# EAGLE schematic PDNode-600 Pro (EAGLE 9.2.1), part 1 of 2
COMPANY: DvidMakesThings; REVISION: 1.0.0; WEB: https://github.com/DvidMakesThings/HW_PDNode-600-Pro

## Sheet 1 of 15: MICROCONTROLLER - POWER
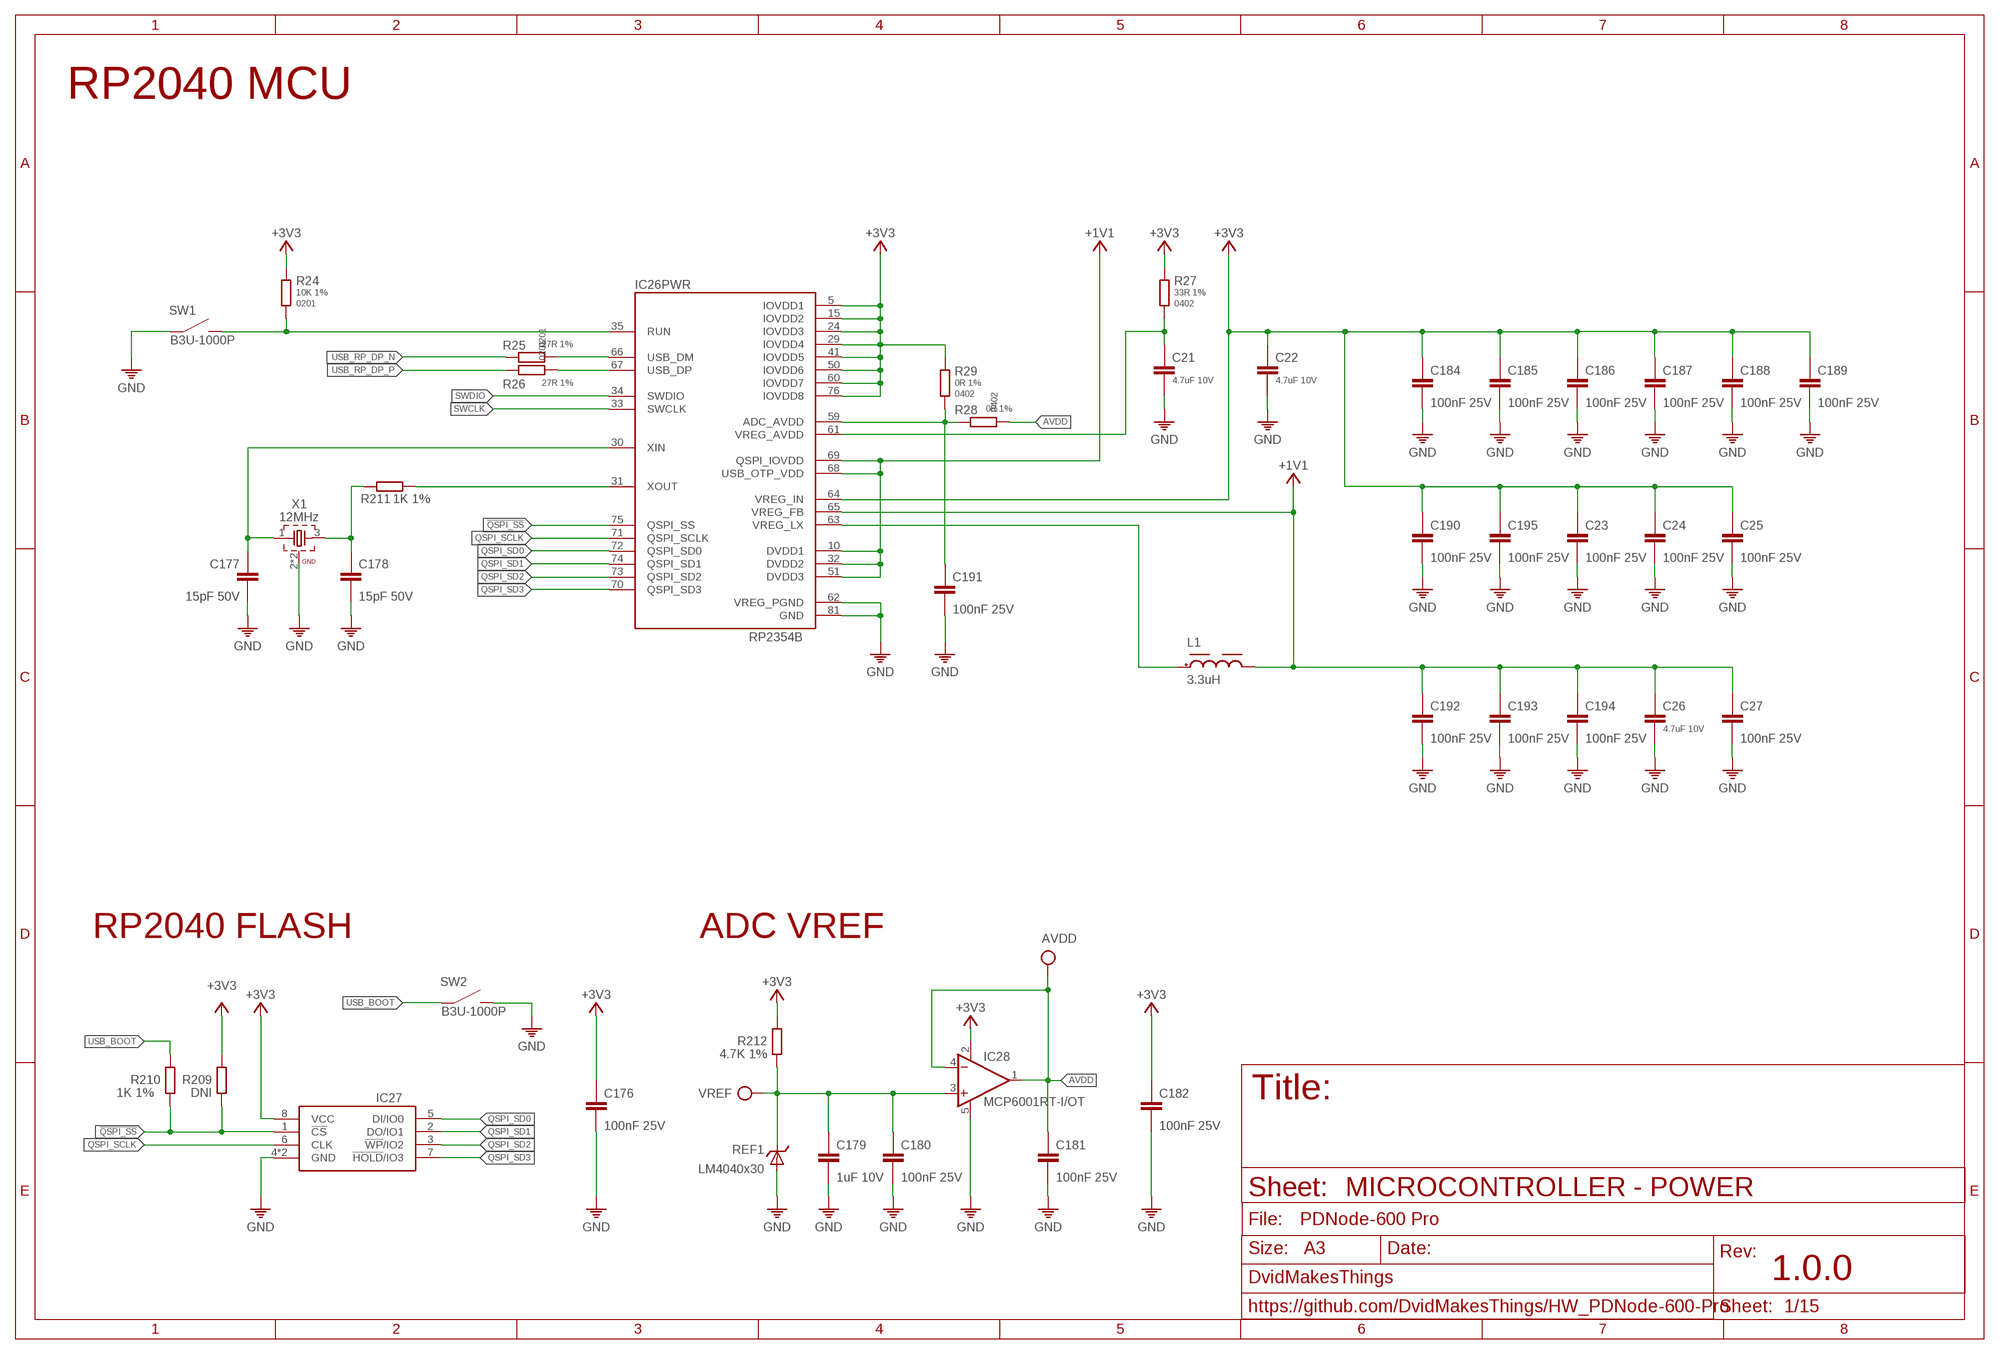
[diagram p0: schematic, sheet 1]

### Parts
AVDD  TESTPOINT  TP  [TP]
C21  4.7uF 10V  4.7UF-10V0402  [0402]
C22  4.7uF 10V  4.7UF-10V0402  [0402]
C23  100nF 25V  100NF-25V-0201  [0201]
C24  100nF 25V  100NF-25V-0201  [0201]
C25  100nF 25V  100NF-25V-0201  [0201]
C26  4.7uF 10V  4.7UF-10V0402  [0402]
C27  100nF 25V  100NF-25V-0201  [0201]
C176  100nF 25V  100NF-25V-0201  [0201]
C177  15pF 50V  15PF-50V0201  [0201]
C178  15pF 50V  15PF-50V0201  [0201]
C179  1uF 10V  1UF-10V0201  [0201]
C180  100nF 25V  100NF-25V-0201  [0201]
C181  100nF 25V  100NF-25V-0201  [0201]
C182  100nF 25V  100NF-25V-0201  [0201]
C184  100nF 25V  100NF-25V-0201  [0201]
C185  100nF 25V  100NF-25V-0201  [0201]
C186  100nF 25V  100NF-25V-0201  [0201]
C187  100nF 25V  100NF-25V-0201  [0201]
C188  100nF 25V  100NF-25V-0201  [0201]
C189  100nF 25V  100NF-25V-0201  [0201]
C190  100nF 25V  100NF-25V-0201  [0201]
C191  100nF 25V  100NF-25V-0201  [0201]
C192  100nF 25V  100NF-25V-0201  [0201]
C193  100nF 25V  100NF-25V-0201  [0201]
C194  100nF 25V  100NF-25V-0201  [0201]
C195  100nF 25V  100NF-25V-0201  [0201]
IC26  RP2354B  RP235XB  [QFN80-10X10]
IC27  W25Q128JVPIQ  W25Q128JVP  [SON127P600X500X75-8N]
IC28  MCP6001RT-I/OT  MCP6001RT  [SOT23-5]
L1  3.3uH  3.3UH0805  [0805]
R24  10K 1%  10K-1%0201  [0201]
R25  27R 1%  27R-1%0201  [0201]
R26  27R 1%  27R-1%0201  [0201]
R27  33R 1%  33R-1%0402  [0402]
R28  0R 1%  0R0402  [0402]
R29  0R 1%  0R0402  [0402]
R209  DNI  R0201  [R0201]
R210  1K 1%  1K-1%0201  [0201]
R211  1K 1%  1K-1%0201  [0201]
R212  4.7K 1%  4.7K-1%0201  [0201]
REF1  LM4040x30  LM4040BXX  [SOT23]
SW1  B3U-1000P  B3U-1000P  [B3U-1000P]
SW2  B3U-1000P  B3U-1000P  [B3U-1000P]
VREF  TESTPOINT  TP  [TP]
X1  12MHz  CRYSTAL-3225X322512MSB4SI  [WE-XTAL_CFPX-180]

### Nets
!QSPI_SS: IC26.75(PWR:QSPI_SS) IC27.1(!CS) R209.1 R210.2
+1V1: C26.1 C27.1 C192.1 C193.1 C194.1 IC26.10(PWR:DVDD1) IC26.32(PWR:DVDD2) IC26.51(PWR:DVDD3) IC26.65(PWR:VREG_FB) IC26.68(PWR:USB_OTP_VDD) IC26.69(PWR:QSPI_IOVDD) L1.2
+3V3: C22.1 C23.1 C24.1 C25.1 C176.1 C182.1 C184.1 C185.1 C186.1 C187.1 C188.1 C189.1 C190.1 C195.1 IC26.5(PWR:IOVDD1) IC26.15(PWR:IOVDD2) IC26.24(PWR:IOVDD3) IC26.29(PWR:IOVDD4) IC26.41(PWR:IOVDD5) IC26.50(PWR:IOVDD6) IC26.60(PWR:IOVDD7) IC26.64(PWR:VREG_IN) IC26.76(PWR:IOVDD8) IC27.8(VCC) IC28.2(V+) R24.1 R27.1 R29.1 R209.2 R212.2 ; also sheet 2,3,4,5,6,7,8
AVDD: AVDD.TP C181.1 IC28.1(OUT) IC28.4(-IN) R28.2
GND: C21.2 C22.2 C23.2 C24.2 C25.2 C26.2 C27.2 C176.2 C177.2 C178.2 C179.2 C180.2 C181.2 C182.2 C184.2 C185.2 C186.2 C187.2 C188.2 C189.2 C190.2 C191.2 C192.2 C193.2 C194.2 C195.2 IC26.62(PWR:VREG_PGND) IC26.81(PWR:GND) IC27.4(GND) IC27.PAD(GND) IC28.5(V-) REF1.2(A) REF1.3(A) SW1.1 SW2.2 X1.2(GND) X1.4(GND) ; also sheet 2,3,4,5,6,7,8
N$16: IC26.35(PWR:RUN) R24.2 SW1.2
N$17: IC26.66(PWR:USB_DM) R25.2
N$18: IC26.67(PWR:USB_DP) R26.2
N$20: C191.1 IC26.59(PWR:ADC_AVDD) R28.1 R29.2
N$21: C21.1 IC26.61(PWR:VREG_AVDD) R27.2
N$23: IC26.63(PWR:VREG_LX) L1.1
N$43: C178.1 R211.1 X1.3
QSPI_SCLK: IC26.71(PWR:QSPI_SCLK) IC27.6(CLK)
QSPI_SD0: IC26.72(PWR:QSPI_SD0) IC27.5(DI/IO0)
QSPI_SD1: IC26.74(PWR:QSPI_SD1) IC27.2(DO/IO1)
QSPI_SD2: IC26.73(PWR:QSPI_SD2) IC27.3(!WP!/IO2)
QSPI_SD3: IC26.70(PWR:QSPI_SD3) IC27.7(!HOLD!/IO3)
RP_XI: C177.1 IC26.30(PWR:XIN) X1.1
RP_XO: IC26.31(PWR:XOUT) R211.2
SWCLK: IC26.33(PWR:SWCLK)
SWDIO: IC26.34(PWR:SWDIO)
USB_BOOT: R210.1 SW2.1
USB_RP_DP_N: R25.1
USB_RP_DP_P: R26.1
VREF: C179.1 C180.1 IC28.3(+IN) R212.1 REF1.1(C) VREF.TP

### Notes on the sheet
- RP2040 MCU
- RP2040 FLASH | ADC VREF
- MICROCONTROLLER - POWER

## Sheet 2 of 15: MICROCONTROLLER - GPIO
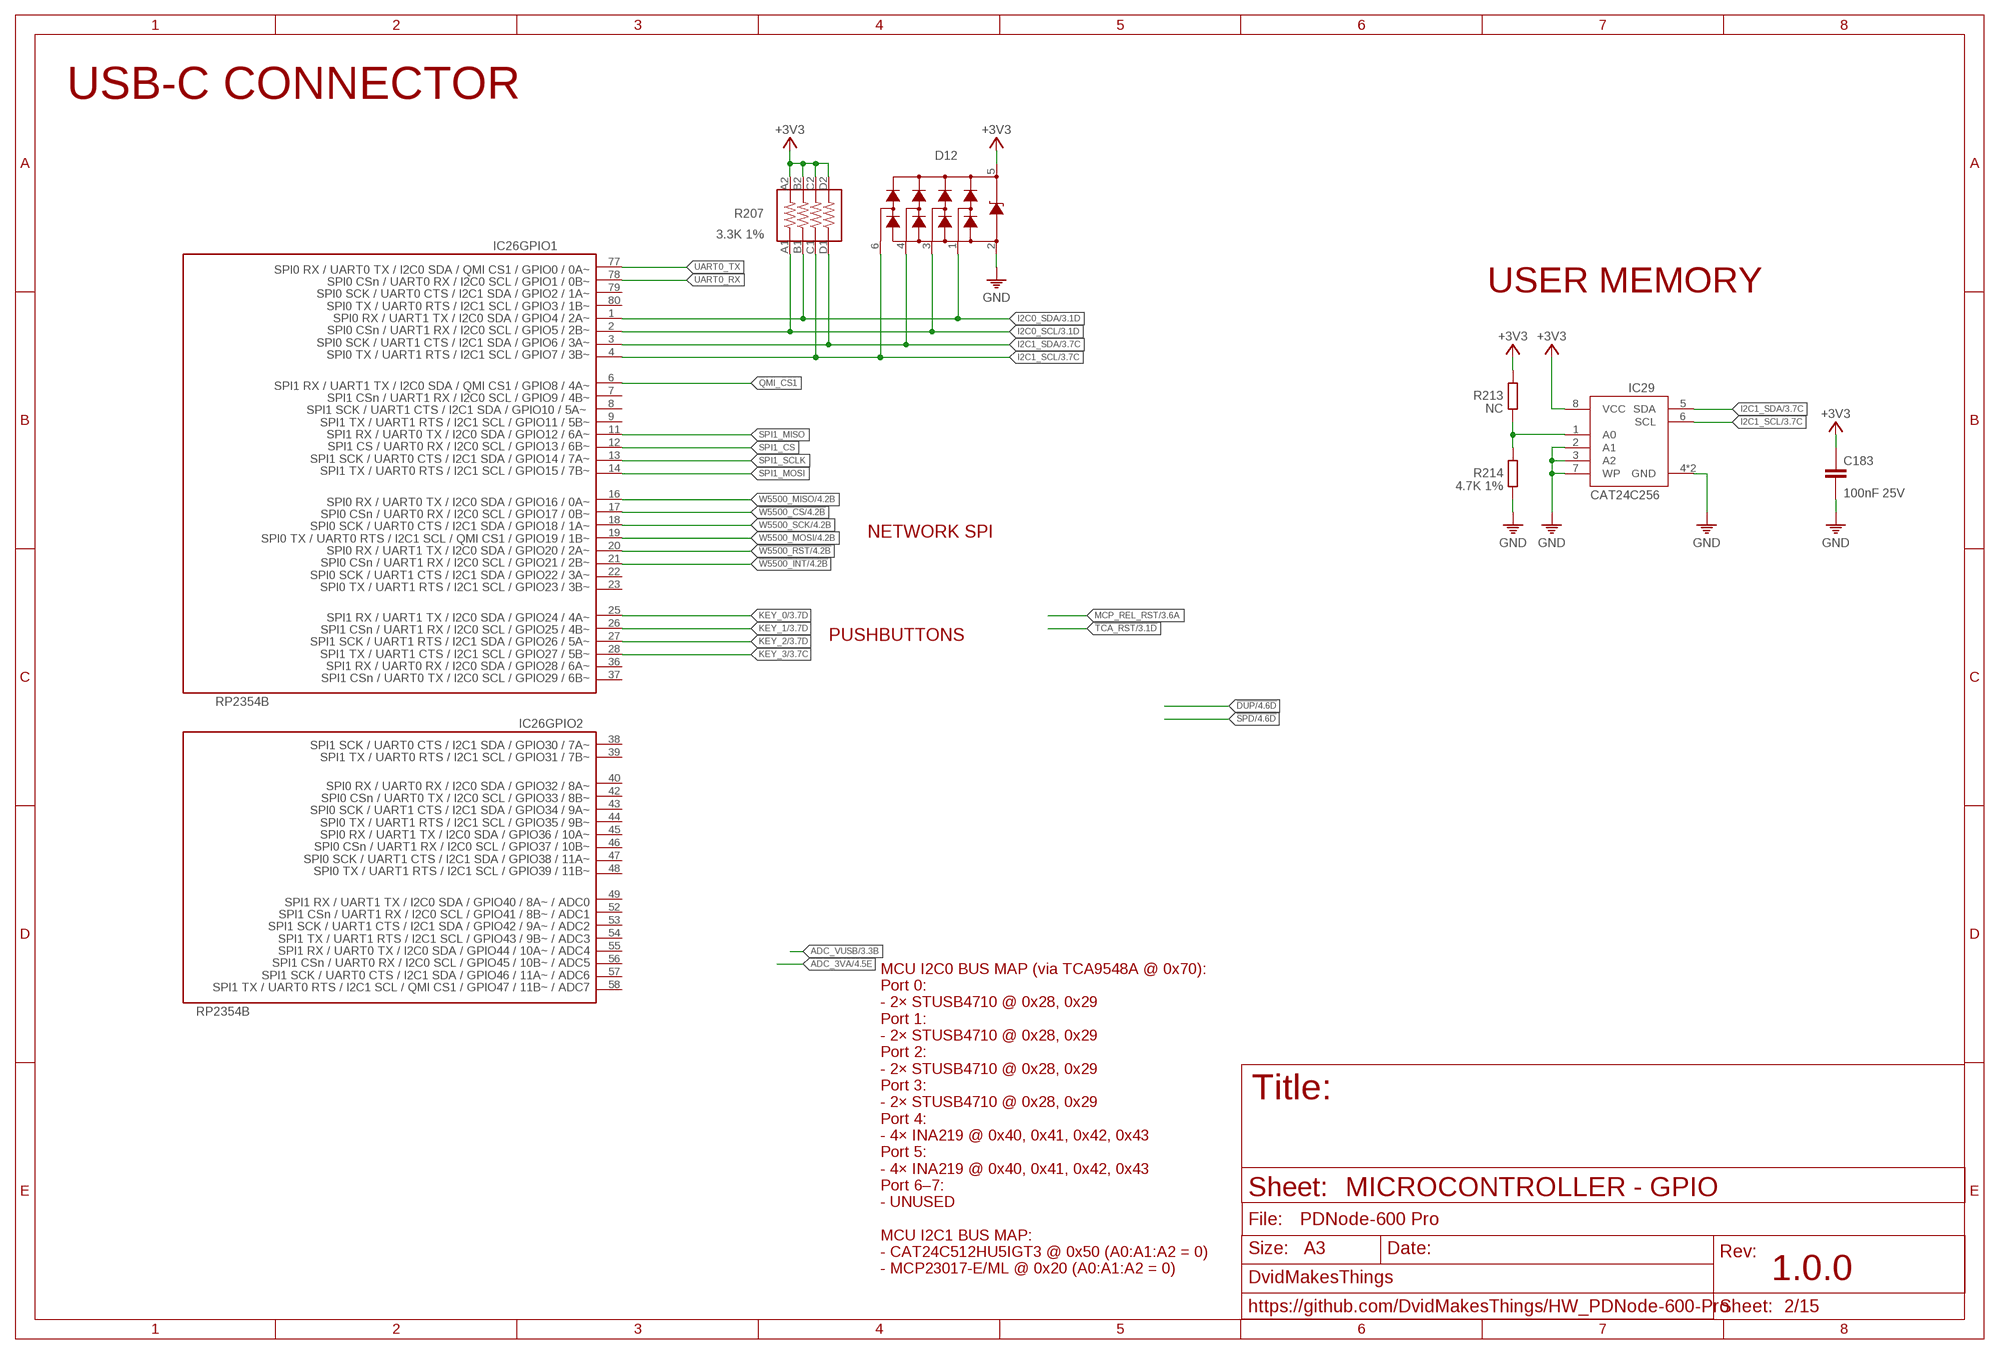
[diagram p1: schematic, sheet 2]

### Parts
C183  100nF 25V  100NF-25V-0201  [0201]
D12  HDMIULC6-4SC6Y  [SOT23-6]
IC29  CAT24C256HU4IGT3  CAT24C256-HU4  [SON50P300X200X50-9T130X140N]
R207  3.3K 1%  3.3K-1%_ARRAY0603X4-1206  [_0603X4-1206]
R213  NC  R0201  [R0201]
R214  4.7K 1%  4.7K-1%0201  [0201]

### Nets
!W5500_CS: IC26.17(GPIO1:GPIO17) ; also sheet 4
!W5500_INT: IC26.21(GPIO1:GPIO21) ; also sheet 4
!W5500_RST: IC26.20(GPIO1:GPIO20) ; also sheet 4
+3V3: C183.1 D12.5 IC29.8(VCC) R207.A2 R207.B2 R207.C2 R207.D2 R213.2 ; also sheet 1,3,4,5,6,7,8
GND: C183.2 D12.2 IC29.2(A1) IC29.3(A2) IC29.4(GND) IC29.7(WP) IC29.9(GND) R214.1 ; also sheet 1,3,4,5,6,7,8
I2C0_SCL: D12.3 IC26.2(GPIO1:GPIO5) R207.A1 ; also sheet 3
I2C0_SDA: D12.1 IC26.1(GPIO1:GPIO4) R207.B1 ; also sheet 3
I2C1_SCL: D12.6 IC26.4(GPIO1:GPIO7) IC29.6(SCL) R207.C1 ; also sheet 3
I2C1_SDA: D12.4 IC26.3(GPIO1:GPIO6) IC29.5(SDA) R207.D1 ; also sheet 3
KEY_0: IC26.25(GPIO1:GPIO24) ; also sheet 3
KEY_1: IC26.26(GPIO1:GPIO25) ; also sheet 3
KEY_2: IC26.27(GPIO1:GPIO26) ; also sheet 3
KEY_3: IC26.28(GPIO1:GPIO27) ; also sheet 3
N$222: IC29.1(A0) R213.1 R214.2
QMI_CS1: IC26.6(GPIO1:GPIO8)
SPI1_CS: IC26.12(GPIO1:GPIO13)
SPI1_MISO: IC26.11(GPIO1:GPIO12)
SPI1_MOSI: IC26.14(GPIO1:GPIO15)
SPI1_SCLK: IC26.13(GPIO1:GPIO14)
UART0_RX: IC26.78(GPIO1:GPIO1)
UART0_TX: IC26.77(GPIO1:GPIO0)
W5500_MISO: IC26.16(GPIO1:GPIO16) ; also sheet 4
W5500_MOSI: IC26.19(GPIO1:GPIO19) ; also sheet 4
W5500_SCK: IC26.18(GPIO1:GPIO18) ; also sheet 4
Unconnected: IC26.7(GPIO1:GPIO9) IC26.8(GPIO1:GPIO10) IC26.9(GPIO1:GPIO11) IC26.22(GPIO1:GPIO22) IC26.23(GPIO1:GPIO23) IC26.36(GPIO1:GPIO28) IC26.37(GPIO1:GPIO29) IC26.38(GPIO2:GPIO30) IC26.39(GPIO2:GPIO31) IC26.40(GPIO2:GPIO32) IC26.42(GPIO2:GPIO33) IC26.43(GPIO2:GPIO34) IC26.44(GPIO2:GPIO35) IC26.45(GPIO2:GPIO36) IC26.46(GPIO2:GPIO37) IC26.47(GPIO2:GPIO38) IC26.48(GPIO2:GPIO39) IC26.49(GPIO2:GPIO40_ADC0) IC26.52(GPIO2:GPIO41_ADC1) IC26.53(GPIO2:GPIO42_ADC2) IC26.54(GPIO2:GPIO43_ADC3) IC26.55(GPIO2:GPIO44_ADC4) IC26.56(GPIO2:GPIO45_ADC5) IC26.57(GPIO2:GPIO46_ADC6) IC26.58(GPIO2:GPIO47_ADC7) IC26.79(GPIO1:GPIO2) IC26.80(GPIO1:GPIO3)

### Notes on the sheet
- USB-C CONNECTOR
- USER MEMORY
- NETWORK SPI
- PUSHBUTTONS
- MICROCONTROLLER - GPIO
- MCU I2C0 BUS MAP (via TCA9548A @ 0x70):
  Port 0:
  - 2× STUSB4710 @ 0x28, 0x29
  Port 1:
  - 2× STUSB4710 @ 0x28, 0x29
  Port 2:
  - 2× STUSB4710 @ 0x28, 0x29
  Port 3:
  - 2× STUSB4710 @ 0x28, 0x29
  Port 4:
  - 4× INA219 @ 0x40, 0x41, 0x42, 0x43
  Port 5:
  - 4× INA219 @ 0x40, 0x41, 0x42, 0x43
  Port 6–7:
  - UNUSED
  
  MCU I2C1 BUS MAP:
  - CAT24C512HU5IGT3 @ 0x50 (A0:A1:A2 = 0)
  - MCP23017-E/ML @ 0x20 (A0:A1:A2 = 0)

## Sheet 3 of 15: PERIPHERALS
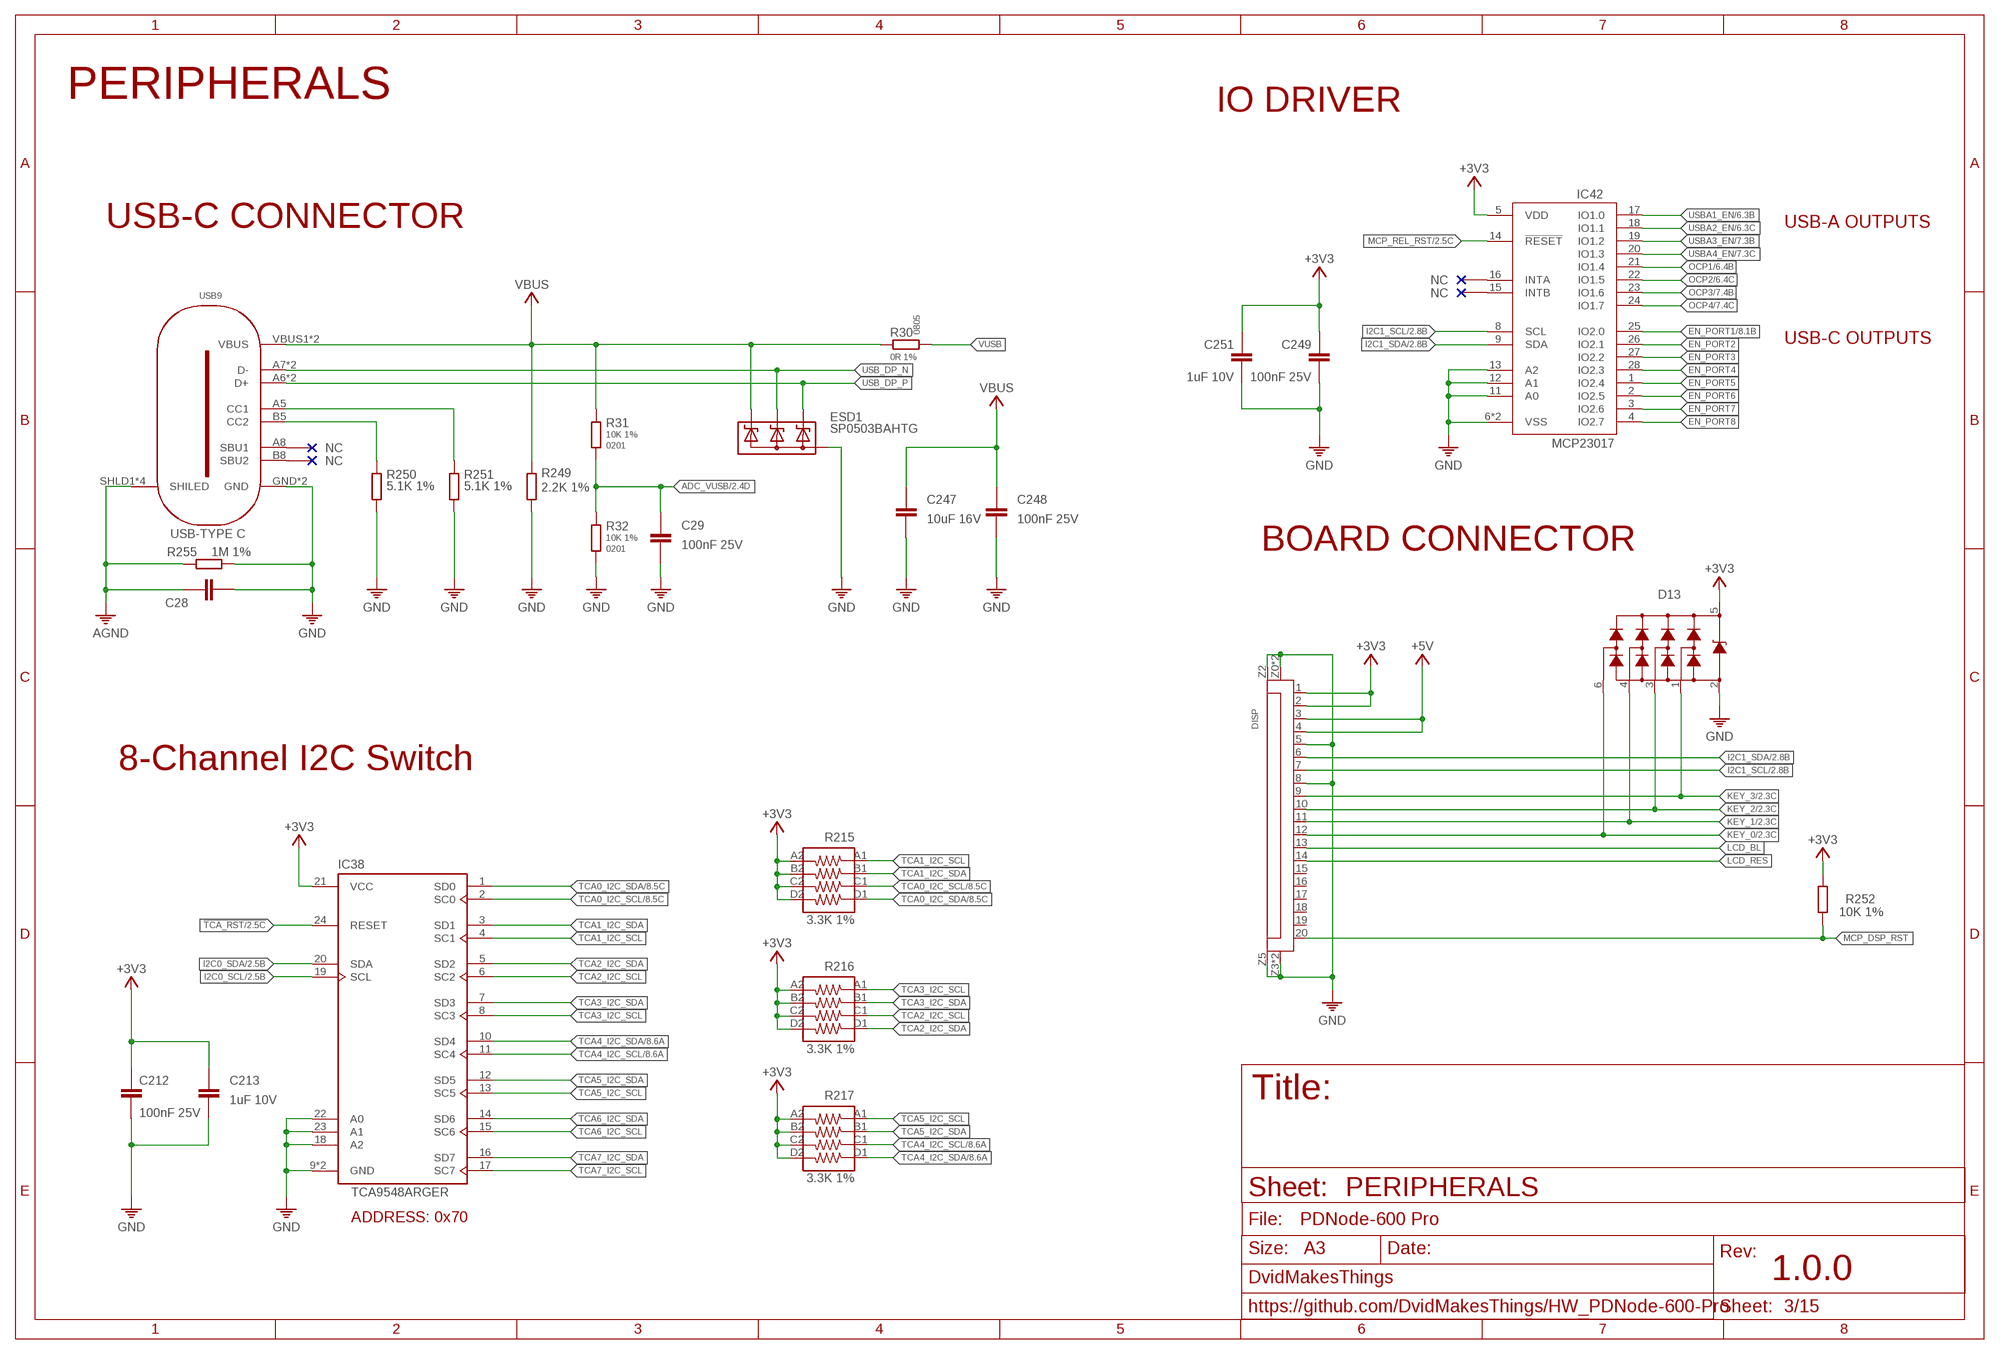
[diagram p2: schematic, sheet 3]

### Parts
C28  1NF-2KV  [1206]
C29  100nF 25V  100NF-25V-0402  [0402]
C212  100nF 25V  100NF-25V-0201  [0201]
C213  1uF 10V  1UF-10V0201  [0201]
C247  10uF 16V  10UF-16V-0603  [0603]
C248  100nF 25V  100NF-25V-0402  [0402]
C249  100nF 25V  100NF-25V-0201  [0201]
C251  1uF 10V  1UF-10V0201  [0201]
D13  HDMIULC6-4SC6Y  [SOT23-6]
DISP  AFC11-S20ICC-00  AFC11-S20ICC-00  [FPC20]
ESD1  SP0503BAHTG  SP0503BAHT  [SOT143]
IC38  TCA9548ARGER  [QFN50P400X400X100-25T210N]
IC42  MCP23017T-E/ML  MCP23017-E/ML  [QFN28[6X6]ML]
R30  0R 1%  0R0805  [0805]
R31  10K 1%  10K-1%0201  [0201]
R32  10K 1%  10K-1%0201  [0201]
R215  3.3K 1%  3.3K-1%_ARRAY0603X4-1206  [_0603X4-1206]
R216  3.3K 1%  3.3K-1%_ARRAY0603X4-1206  [_0603X4-1206]
R217  3.3K 1%  3.3K-1%_ARRAY0603X4-1206  [_0603X4-1206]
R249  2.2K 1%  2.2K-1%0201  [0201]
R250  5.1K 1%  5.1K-1%0201  [0201]
R251  5.1K 1%  5.1K-1%0201  [0201]
R252  10K 1%  10K-1%0201  [0201]
R255  1M 1%  1M-1%0603  [0603]
USB9  USB-TYPE-C-018  USB_C-THT  [USB-C]

### Nets
!TCA_RST: IC38.24(RESET) ; also sheet 2
+3V3: C212.1 C213.1 C249.1 C251.1 D13.5 DISP.1 DISP.2 IC38.21(VCC) IC42.5(VDD) R215.A2 R215.B2 R215.C2 R215.D2 R216.A2 R216.B2 R216.C2 R216.D2 R217.A2 R217.B2 R217.C2 R217.D2 R252.2 ; also sheet 1,2,4,5,6,7,8
+5V: DISP.3 DISP.4
ADC_VUSB: C29.1 R31.2 R32.1 ; also sheet 2
AGND: C28.1 R255.1 USB9.SHLD1(SHILED) USB9.SHLD2(SHILED) USB9.SHLD3(SHILED) USB9.SHLD4(SHILED) ; also sheet 5,6,7,8
CC1: R251.1 USB9.A5(CC1)
CC2: R250.1 USB9.B5(CC2)
EN_PORT1: IC42.25(IO2.0) ; also sheet 8
EN_PORT2: IC42.26(IO2.1)
EN_PORT3: IC42.27(IO2.2)
EN_PORT4: IC42.28(IO2.3)
EN_PORT5: IC42.1(IO2.4)
EN_PORT6: IC42.2(IO2.5)
EN_PORT7: IC42.3(IO2.6)
EN_PORT8: IC42.4(IO2.7)
GND: C28.2 C29.2 C212.2 C213.2 C247.2 C248.2 C249.2 C251.2 D13.2 DISP.5 DISP.8 DISP.Z0(Z1) DISP.Z1 DISP.Z2 DISP.Z3 DISP.Z4(Z3) DISP.Z5(Z4) ESD1.1(A) IC38.9(GND) IC38.18(A2) IC38.22(A0) IC38.23(A1) IC38.25(GND) IC42.6(VSS) IC42.11(A0) IC42.12(A1) IC42.13(A2) IC42.PAD(VSS) R32.2 R249.2 R250.2 R251.2 R255.2 USB9.GND USB9.GND2(GND) ; also sheet 1,2,4,5,6,7,8
I2C0_SCL: IC38.19(SCL) ; also sheet 2
I2C0_SDA: IC38.20(SDA) ; also sheet 2
I2C1_SCL: DISP.7 IC42.8(SCL) ; also sheet 2
I2C1_SDA: DISP.6 IC42.9(SDA) ; also sheet 2
KEY_0: D13.6 DISP.12 ; also sheet 2
KEY_1: D13.4 DISP.11 ; also sheet 2
KEY_2: D13.3 DISP.10 ; also sheet 2
KEY_3: D13.1 DISP.9 ; also sheet 2
LCD_BL: DISP.13
LCD_RES: DISP.14
MCP_DSP_RST: DISP.20 R252.1
MCP_REL_RST: IC42.14(!RESET) ; also sheet 2
OCP1: IC42.21(IO1.4) ; also sheet 6
OCP2: IC42.22(IO1.5) ; also sheet 6
OCP3: IC42.23(IO1.6) ; also sheet 7
OCP4: IC42.24(IO1.7) ; also sheet 7
TCA0_I2C_SCL: IC38.2(SC0) R215.C1 ; also sheet 8
TCA0_I2C_SDA: IC38.1(SD0) R215.D1 ; also sheet 8
TCA1_I2C_SCL: IC38.4(SC1) R215.A1
TCA1_I2C_SDA: IC38.3(SD1) R215.B1
TCA2_I2C_SCL: IC38.6(SC2) R216.C1
TCA2_I2C_SDA: IC38.5(SD2) R216.D1
TCA3_I2C_SCL: IC38.8(SC3) R216.A1
TCA3_I2C_SDA: IC38.7(SD3) R216.B1
TCA4_I2C_SCL: IC38.11(SC4) R217.C1 ; also sheet 8
TCA4_I2C_SDA: IC38.10(SD4) R217.D1 ; also sheet 8
TCA5_I2C_SCL: IC38.13(SC5) R217.A1
TCA5_I2C_SDA: IC38.12(SD5) R217.B1
TCA6_I2C_SCL: IC38.15(SC6)
TCA6_I2C_SDA: IC38.14(SD6)
TCA7_I2C_SCL: IC38.17(SC7)
TCA7_I2C_SDA: IC38.16(SD7)
USB_DP_N [90R_DIFFPAIR]: ESD1.3(C2) USB9.A7(D-) USB9.B7(D-)
USB_DP_P [90R_DIFFPAIR]: ESD1.2(C1) USB9.A6(D+) USB9.B6(D+)
USBA1_EN: IC42.17(IO1.0) ; also sheet 6
USBA2_EN: IC42.18(IO1.1) ; also sheet 6
USBA3_EN: IC42.19(IO1.2) ; also sheet 7
USBA4_EN: IC42.20(IO1.3) ; also sheet 7
VBUS: C247.1 C248.1 ESD1.4(C3) R30.1 R31.1 R249.1 USB9.VBUS1(VBUS) USB9.VBUS2(VBUS)
VUSB: R30.2
Unconnected: DISP.15 DISP.16 DISP.17 DISP.18 DISP.19 IC42.15(INTB) IC42.16(INTA) USB9.A8(SBU1) USB9.B8(SBU2)

### Notes on the sheet
- PERIPHERALS
- IO DRIVER
- USB-C CONNECTOR | USB-A OUTPUTS
- USB-C OUTPUTS
- BOARD CONNECTOR
- 8-Channel I2C Switch
- PERIPHERALS
- ADDRESS: 0x70

## Sheet 4 of 15: ETHERNET CONTROLLER
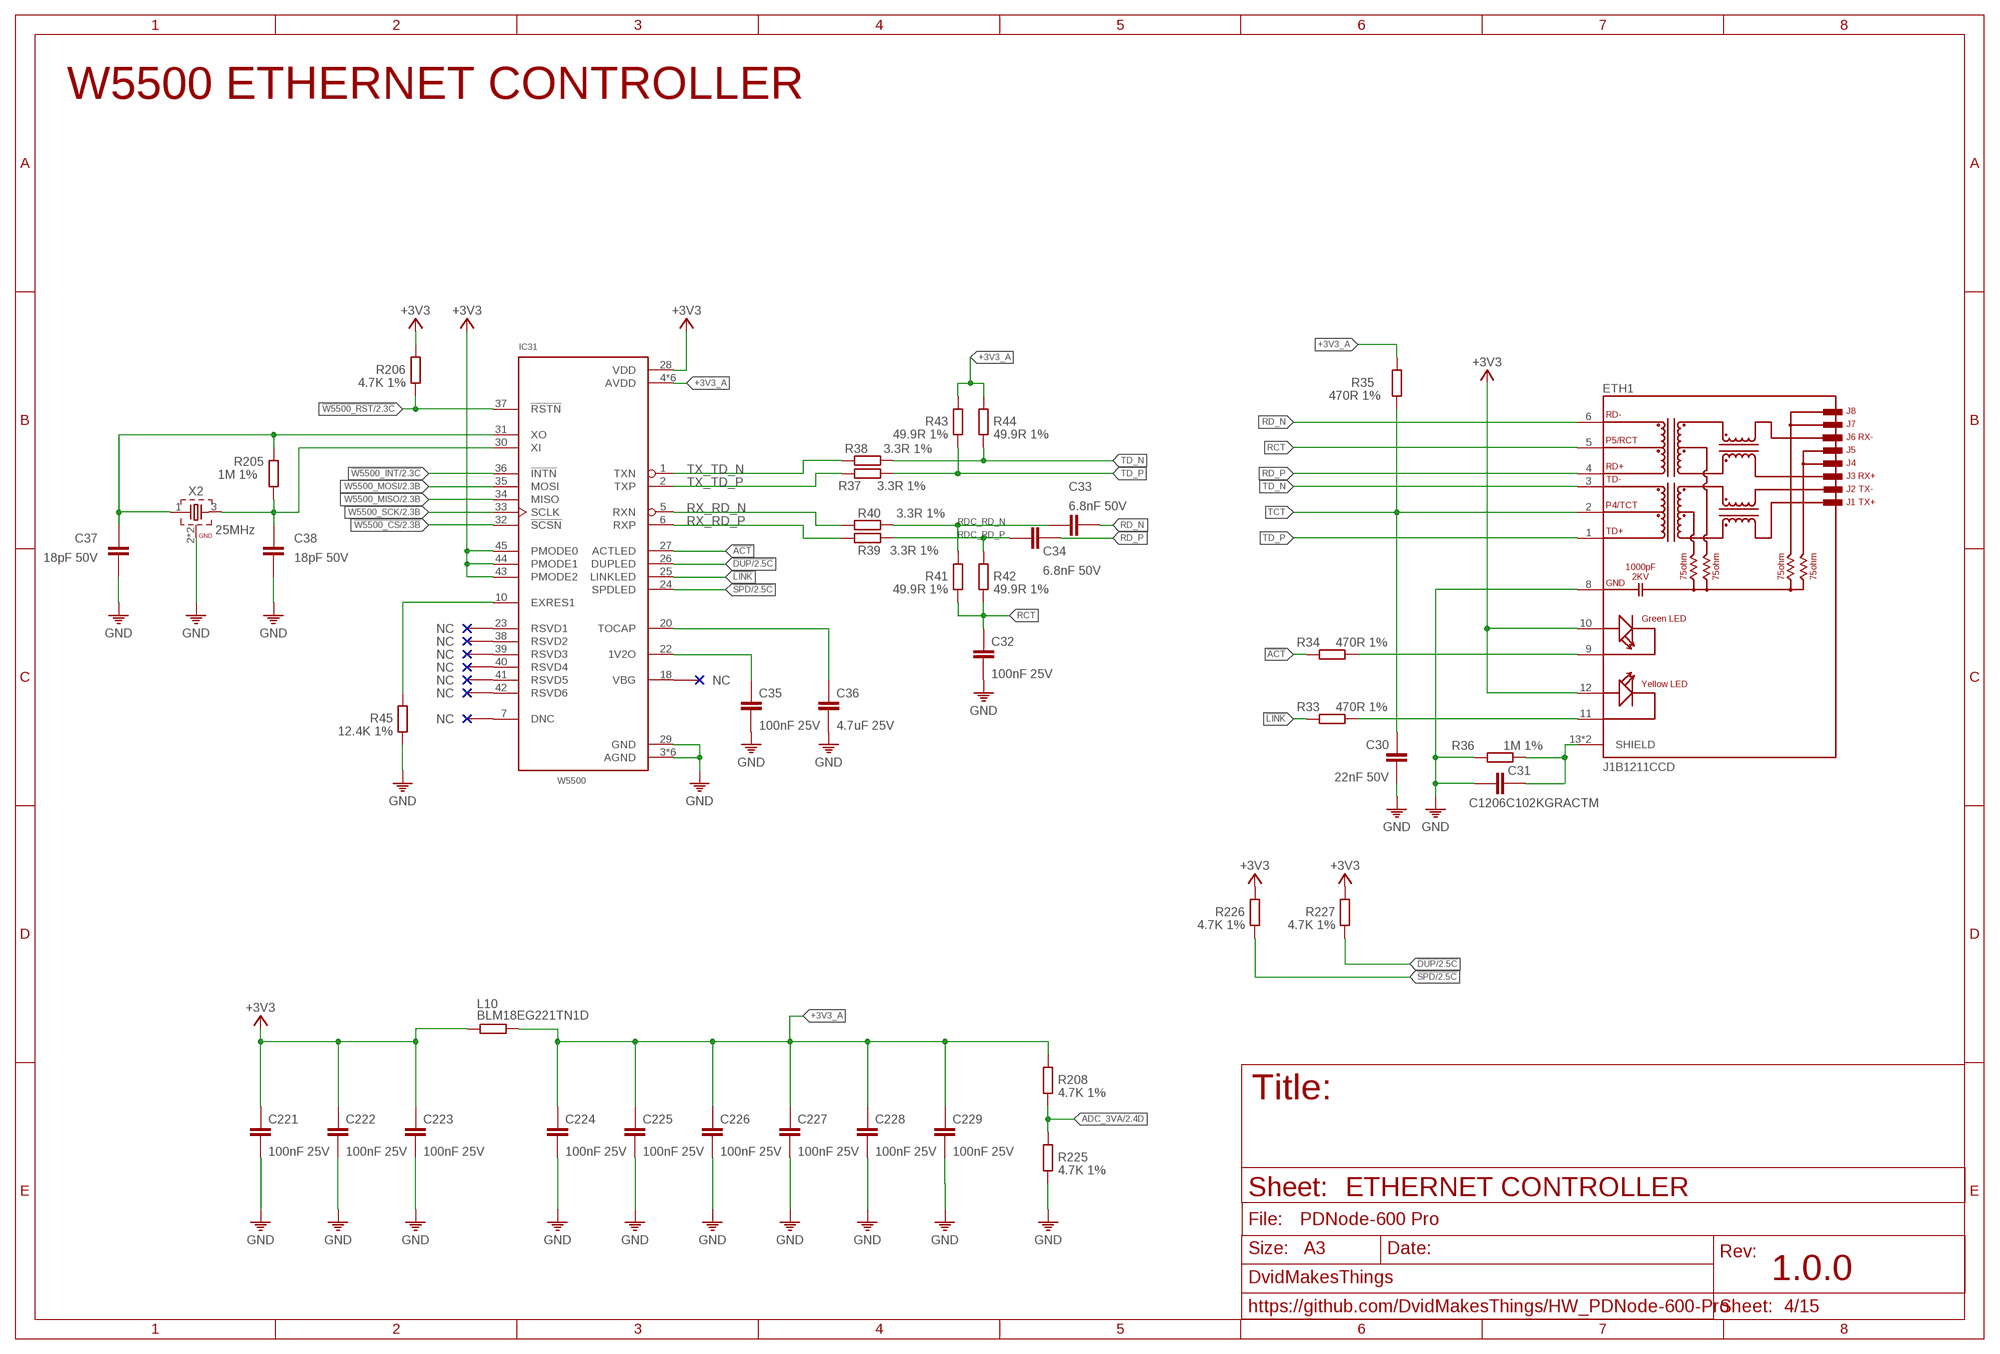
[diagram p3: schematic, sheet 4]

### Parts
C30  22nF 50V  22NF-50V0402  [0402]
C31  C1206C102KGRACTM  C-1206  [C1206]
C32  100nF 25V  100NF-25V-0402  [0402]
C33  6.8nF 50V  6.8NF-50V0201  [0201]
C34  6.8nF 50V  6.8NF-50V0201  [0201]
C35  100nF 25V  100NF-25V-0201  [0201]
C36  4.7uF 25V  4.7UF-25V0402  [0402]
C37  18pF 50V  18PF-50V-0201  [0201]
C38  18pF 50V  18PF-50V-0201  [0201]
C221  100nF 25V  100NF-25V-0201  [0201]
C222  100nF 25V  100NF-25V-0201  [0201]
C223  100nF 25V  100NF-25V-0201  [0201]
C224  100nF 25V  100NF-25V-0201  [0201]
C225  100nF 25V  100NF-25V-0201  [0201]
C226  100nF 25V  100NF-25V-0201  [0201]
C227  100nF 25V  100NF-25V-0201  [0201]
C228  100nF 25V  100NF-25V-0201  [0201]
C229  100nF 25V  100NF-25V-0201  [0201]
ETH1  J1B1211CCD  [J1B1211CCD]
IC31  W5500  [LQFP48]
L10  BLM18EG221TN1D  R0603  [0603]
R33  470R 1%  470R-1%0402  [0402]
R34  470R 1%  470R-1%0402  [0402]
R35  470R 1%  470R-1%0402  [0402]
R36  1M 1%  1M-1%1206  [1206]
R37  3.3R 1%  3.3R-1%0201  [0201]
R38  3.3R 1%  3.3R-1%0201  [0201]
R39  3.3R 1%  3.3R-1%0201  [0201]
R40  3.3R 1%  3.3R-1%0201  [0201]
R41  49.9R 1%  49.9R-1%0201  [0201]
R42  49.9R 1%  49.9R-1%0201  [0201]
R43  49.9R 1%  49.9R-1%0201  [0201]
R44  49.9R 1%  49.9R-1%0201  [0201]
R45  12.4K 1%  R0201  [R0201]
R205  1M 1%  1M-1%0201  [0201]
R206  4.7K 1%  4.7K-1%0201  [0201]
R208  4.7K 1%  4.7K-1%0201  [0201]
R225  4.7K 1%  4.7K-1%0201  [0201]
R226  4.7K 1%  4.7K-1%0201  [0201]
R227  4.7K 1%  4.7K-1%0201  [0201]
X2  25MHz  CRYSTAL-3225X322525MOB4SI  [WE-XTAL_CFPX-180]

### Nets
!ACT: IC31.27(ACTLED) R34.1
!DUP: IC31.26(DUPLED) R227.1 ; also sheet 2
!LINK: IC31.25(LINKLED) R33.1
!SPD: IC31.24(SPDLED) R226.1 ; also sheet 2
!W5500_CS: IC31.32(!SCSN) ; also sheet 2
!W5500_INT: IC31.36(!INTN) ; also sheet 2
!W5500_RST: IC31.37(!RSTN) R206.1 ; also sheet 2
+3V3: C221.1 C222.1 C223.1 ETH1.10(GREEN+) ETH1.12(YELLOW+) IC31.28(VDD) IC31.43(PMODE2) IC31.44(PMODE1) IC31.45(PMODE0) L10.1 R206.2 R226.2 R227.2 ; also sheet 1,2,3,5,6,7,8
+3V3_A: C224.1 C225.1 C226.1 C227.1 C228.1 C229.1 IC31.4(AVDD) IC31.8(AVDD) IC31.11(AVDD) IC31.15(AVDD) IC31.17(AVDD) IC31.21(AVDD) L10.2 R35.2 R43.2 R44.2 R208.2
ADC_3VA: R208.1 R225.2 ; also sheet 2
GND: C30.2 C31.1 C32.2 C35.2 C36.2 C37.2 C38.2 C221.2 C222.2 C223.2 C224.2 C225.2 C226.2 C227.2 C228.2 C229.2 ETH1.8(GND) IC31.3(AGND) IC31.9(AGND) IC31.14(AGND) IC31.16(AGND) IC31.19(AGND) IC31.29(GND) IC31.48(AGND) R36.1 R45.1 R225.1 X2.2(GND) X2.4(GND) ; also sheet 1,2,3,5,6,7,8
N$19: ETH1.11(YELLOW-) R33.2
N$22: ETH1.9(GREEN-) R34.2
N$24: IC31.10(EXRES1) R45.2
N$25: C35.1 IC31.22(1V2O)
N$26: C36.1 IC31.20(TOCAP)
N$27: C38.1 IC31.30(XI) R205.1 X2.3
RCT: C32.1 ETH1.5(P5/RCT) R41.1 R42.1
RD_N [100R_DIFFPAIR]: C33.2 ETH1.6(RD-)
RD_P [100R_DIFFPAIR]: C34.2 ETH1.4(RD+)
RDC_RD_N [100R_DIFFPAIR]: C33.1 R40.2 R41.2
RDC_RD_P [100R_DIFFPAIR]: C34.1 R39.2 R42.2
RX_RD_N [100R_DIFFPAIR]: IC31.5(RXN) R40.1
RX_RD_P [100R_DIFFPAIR]: IC31.6(RXP) R39.1
SH: C31.2 ETH1.13(SHIELD) ETH1.14(SHIELD) R36.2
TCT: C30.1 ETH1.2(P4/TCT) R35.1
TD_N [100R_DIFFPAIR]: ETH1.3(TD-) R38.2 R44.1
TD_P [100R_DIFFPAIR]: ETH1.1(TD+) R37.2 R43.1
TX_TD_N [100R_DIFFPAIR]: IC31.1(TXN) R38.1
TX_TD_P [100R_DIFFPAIR]: IC31.2(TXP) R37.1
W5500_MISO: IC31.34(MISO) ; also sheet 2
W5500_MOSI: IC31.35(MOSI) ; also sheet 2
W5500_SCK: IC31.33(SCLK) ; also sheet 2
XO: C37.1 IC31.31(XO) R205.2 X2.1
Unconnected: IC31.7(DNC) IC31.18(VBG) IC31.23(RSVD1) IC31.38(RSVD2) IC31.39(RSVD3) IC31.40(RSVD4) IC31.41(RSVD5) IC31.42(RSVD6)

### Notes on the sheet
- W5500 ETHERNET CONTROLLER
- ETHERNET CONTROLLER

## Sheet 5 of 15: POWER
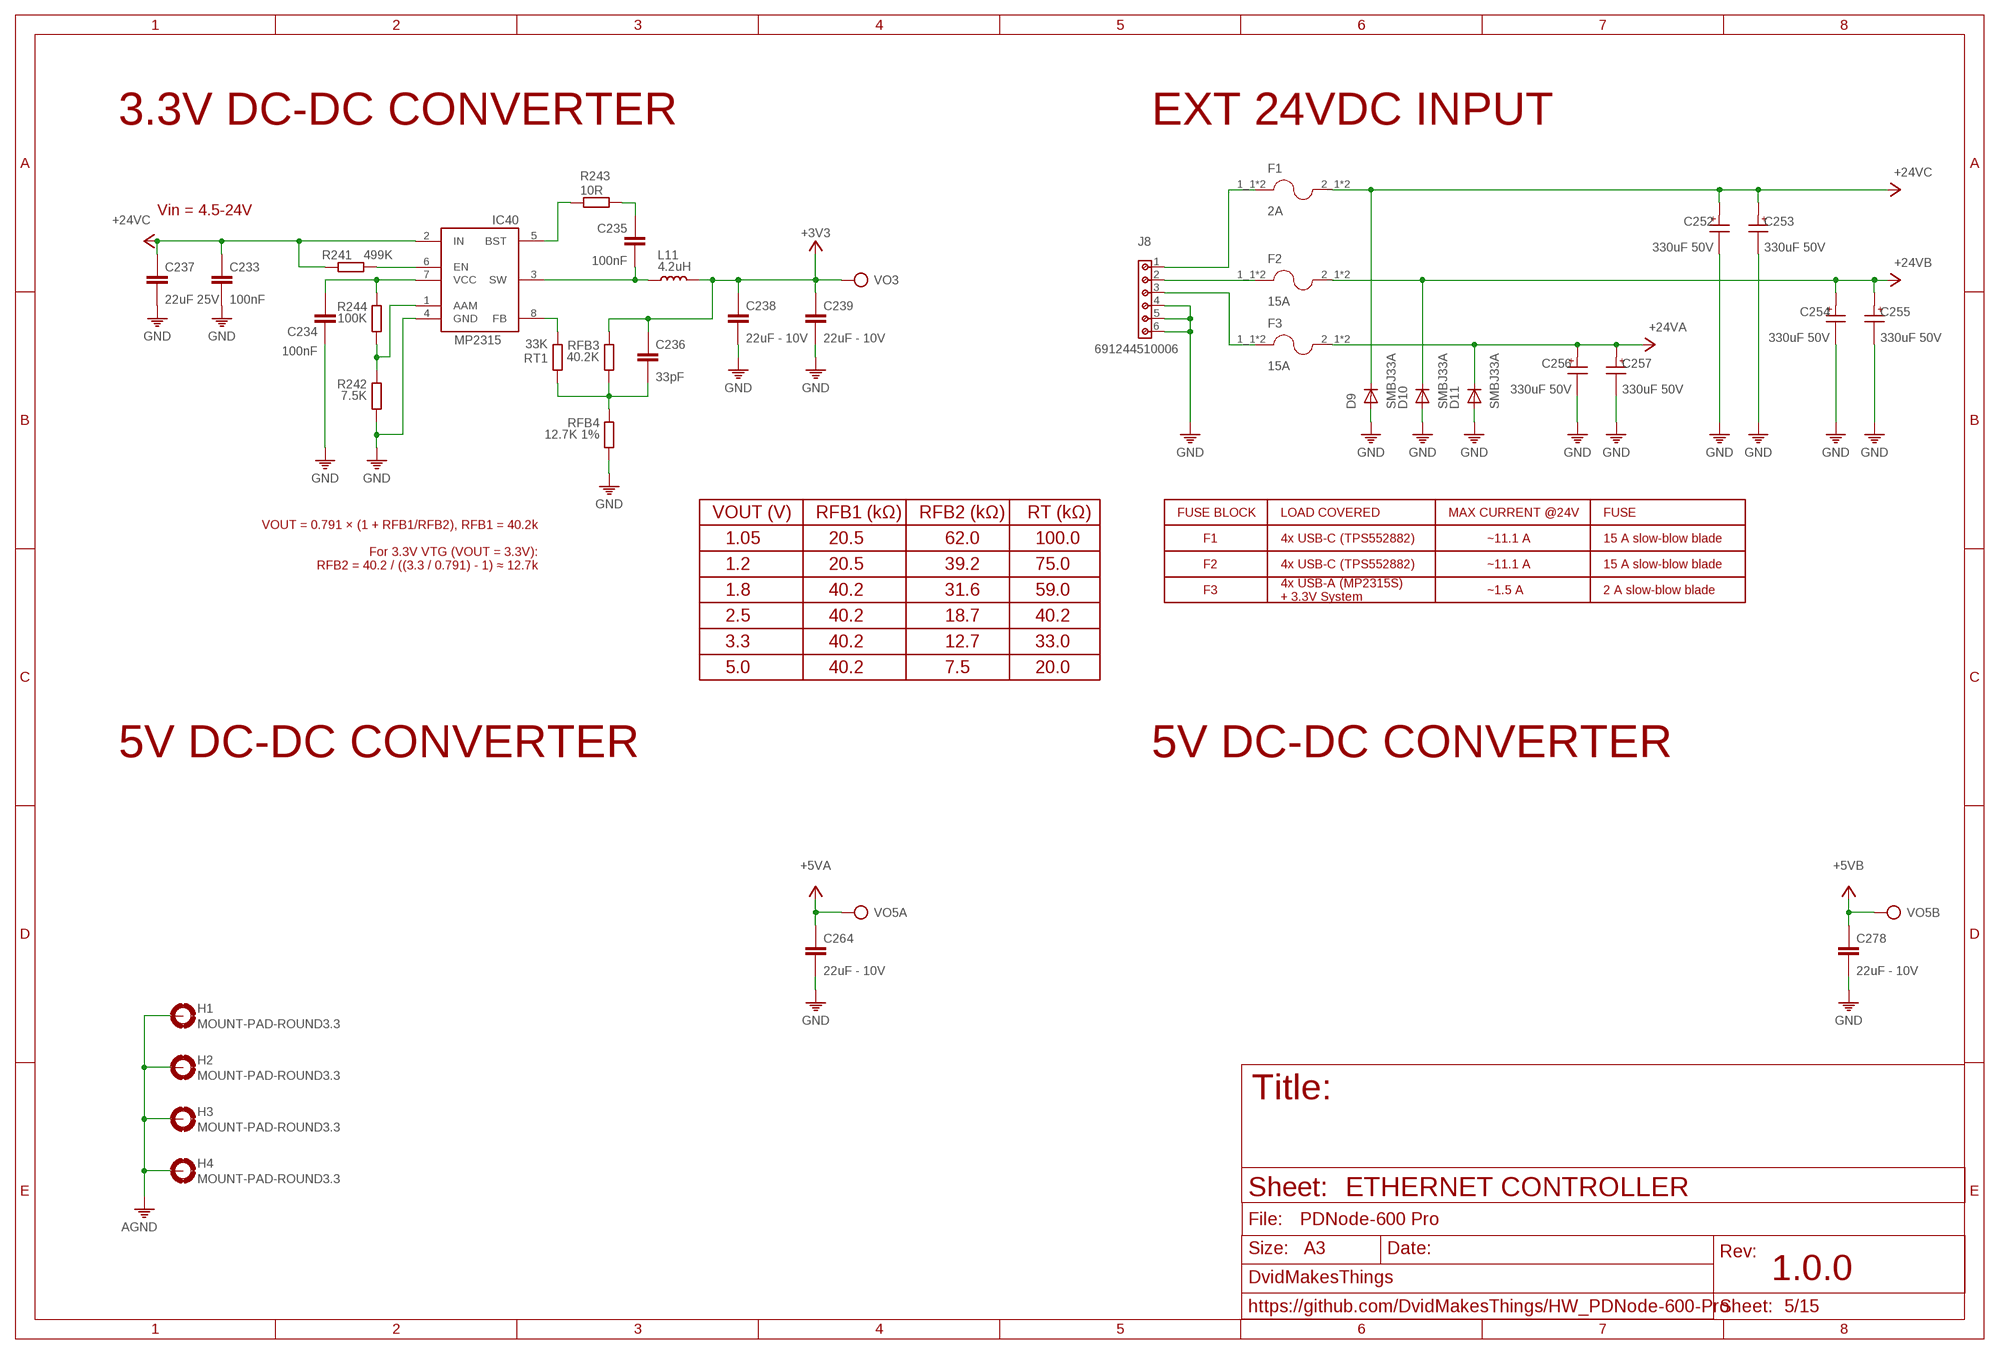
[diagram p4: schematic, sheet 5]

### Parts
C233  100nF  C-0201  [0201]
C234  100nF  C-0201  [0201]
C235  100nF  C-0201  [0201]
C236  33pF  C-0201  [0201]
C237  22uF 25V  C-1206  [C1206]
C238  22uF - 10V  C-1206  [C1206]
C239  22uF - 10V  C-1206  [C1206]
C252  330uF 50V  330UF-50V10X10.5(DXL)  [10X10.5(DXL)]
C253  330uF 50V  330UF-50V10X10.5(DXL)  [10X10.5(DXL)]
C254  330uF 50V  330UF-50V10X10.5(DXL)  [10X10.5(DXL)]
C255  330uF 50V  330UF-50V10X10.5(DXL)  [10X10.5(DXL)]
C256  330uF 50V  330UF-50V10X10.5(DXL)  [10X10.5(DXL)]
C257  330uF 50V  330UF-50V10X10.5(DXL)  [10X10.5(DXL)]
C264  22uF - 10V  C-1206  [C1206]
C278  22uF - 10V  C-1206  [C1206]
D9  SMBJ33A  DIODE-SMB  [SMB]
D10  SMBJ33A  DIODE-SMB  [SMB]
D11  SMBJ33A  DIODE-SMB  [SMB]
F1  2A  BLADE-FUSE  [FUSE_3544-2]
F2  15A  BLADE-FUSE  [FUSE_3544-2]
F3  15A  BLADE-FUSE  [FUSE_3544-2]
H1  MOUNT-PAD-ROUND3.3  [3,3-PAD]
H2  MOUNT-PAD-ROUND3.3  [3,3-PAD]
H3  MOUNT-PAD-ROUND3.3  [3,3-PAD]
H4  MOUNT-PAD-ROUND3.3  [3,3-PAD]
IC40  MP2315GJ-Z  MP2315TSOT23-8  [SOT65P280X110-8N]
J8  691244510006  [691244510006]
L11  4.2uH  L  [SRR5228A]
R241  499K  R0201  [R0201]
R242  7.5K  R0201  [R0201]
R243  10R  R0201  [R0201]
R244  100K  R0201  [R0201]
RFB3  40.2K  R0201  [R0201]
RFB4  12.7K 1%  R0201  [R0201]
RT1  33K  R0201  [R0201]
VO3  TESTPOINT  TP  [TP]
VO5A  TESTPOINT  TP  [TP]
VO5B  TESTPOINT  TP  [TP]

### Nets
3V3_EN_SYS1: IC40.6(EN) R241.2
24VINA: F2.1_1 F2.1_2 J8.2
24VINB: F3.1_1 F3.1_2 J8.3
24VINC: F1.1_1 F1.1_2 J8.1
+3V3: C236.1 C238.1 C239.1 L11.2 RFB3.1 VO3.TP ; also sheet 1,2,3,4,6,7,8
+5VA: C264.1 VO5A.TP ; also sheet 6
+5VB: C278.1 VO5B.TP ; also sheet 7
+24V_A: C256.1(+) C257.1(+) D11.C F3.2_1 F3.2_2 ; supply symbol labelled +24VA ; also sheet 8
+24V_B: C254.1(+) C255.1(+) D10.C F2.2_1 F2.2_2 ; supply symbol labelled +24VB
+24V_C: C233.1 C237.1 C252.1(+) C253.1(+) D9.C F1.2_1 F1.2_2 IC40.2(IN) R241.1 ; supply symbol labelled +24VC
AGND: H1.B3,3(MOUNT) H2.B3,3(MOUNT) H3.B3,3(MOUNT) H4.B3,3(MOUNT) ; also sheet 3,6,7,8
GND: C233.2 C234.2 C237.2 C238.2 C239.2 C252.2(-) C253.2(-) C254.2(-) C255.2(-) C256.2(-) C257.2(-) C264.2 C278.2 D9.A D10.A D11.A IC40.4(GND) J8.4 J8.5 J8.6 R242.2 RFB4.2 ; also sheet 1,2,3,4,6,7,8
N$267: IC40.5(BST) R243.2
N$268: IC40.8(FB) RT1.1
N$269: C235.2 IC40.3(SW) L11.1
N$270: C235.1 R243.1
N$271: C236.2 RFB3.2 RFB4.1 RT1.2
N$275: C234.1 IC40.7(VCC) R244.1
N$276: IC40.1(AAM) R242.1 R244.2

### Notes on the sheet
- 3.3V DC-DC CONVERTER | EXT 24VDC INPUT
- Vin = 4.5-24V
- VOUT (V) | RFB1 (kΩ) | RFB2 (kΩ) | RT (kΩ) | FUSE BLOCK | LOAD COVERED | MAX CURRENT @24V | FUSE
- 1.05 | 20.5 | 62.0 | 100.0 | F1 | 4x USB-C (TPS552882) | ~11.1 A | 15 A slow-blow blade
- 1.2 | 20.5 | 39.2 | 75.0 | F2 | 4x USB-C (TPS552882) | ~11.1 A | 15 A slow-blow blade
- VOUT = 0.791 × (1 + RFB1/RFB2), RFB1 = 40.2k
  
  For 3.3V VTG (VOUT = 3.3V):
     RFB2 = 40.2 / ((3.3 / 0.791) - 1) ≈ 12.7k
- 1.8 | 40.2 | 31.6 | 59.0 | F3
- 4x USB-A (MP2315S) 
  + 3.3V System
- ~1.5 A | 2 A slow-blow blade
- 2.5 | 40.2 | 18.7 | 40.2
- 3.3 | 40.2 | 12.7 | 33.0
- 5.0 | 40.2 | 7.5 | 20.0
- 5V DC-DC CONVERTER | 5V DC-DC CONVERTER
- ETHERNET CONTROLLER

## Sheet 6 of 15: USB-A SOURCE PORT1-2
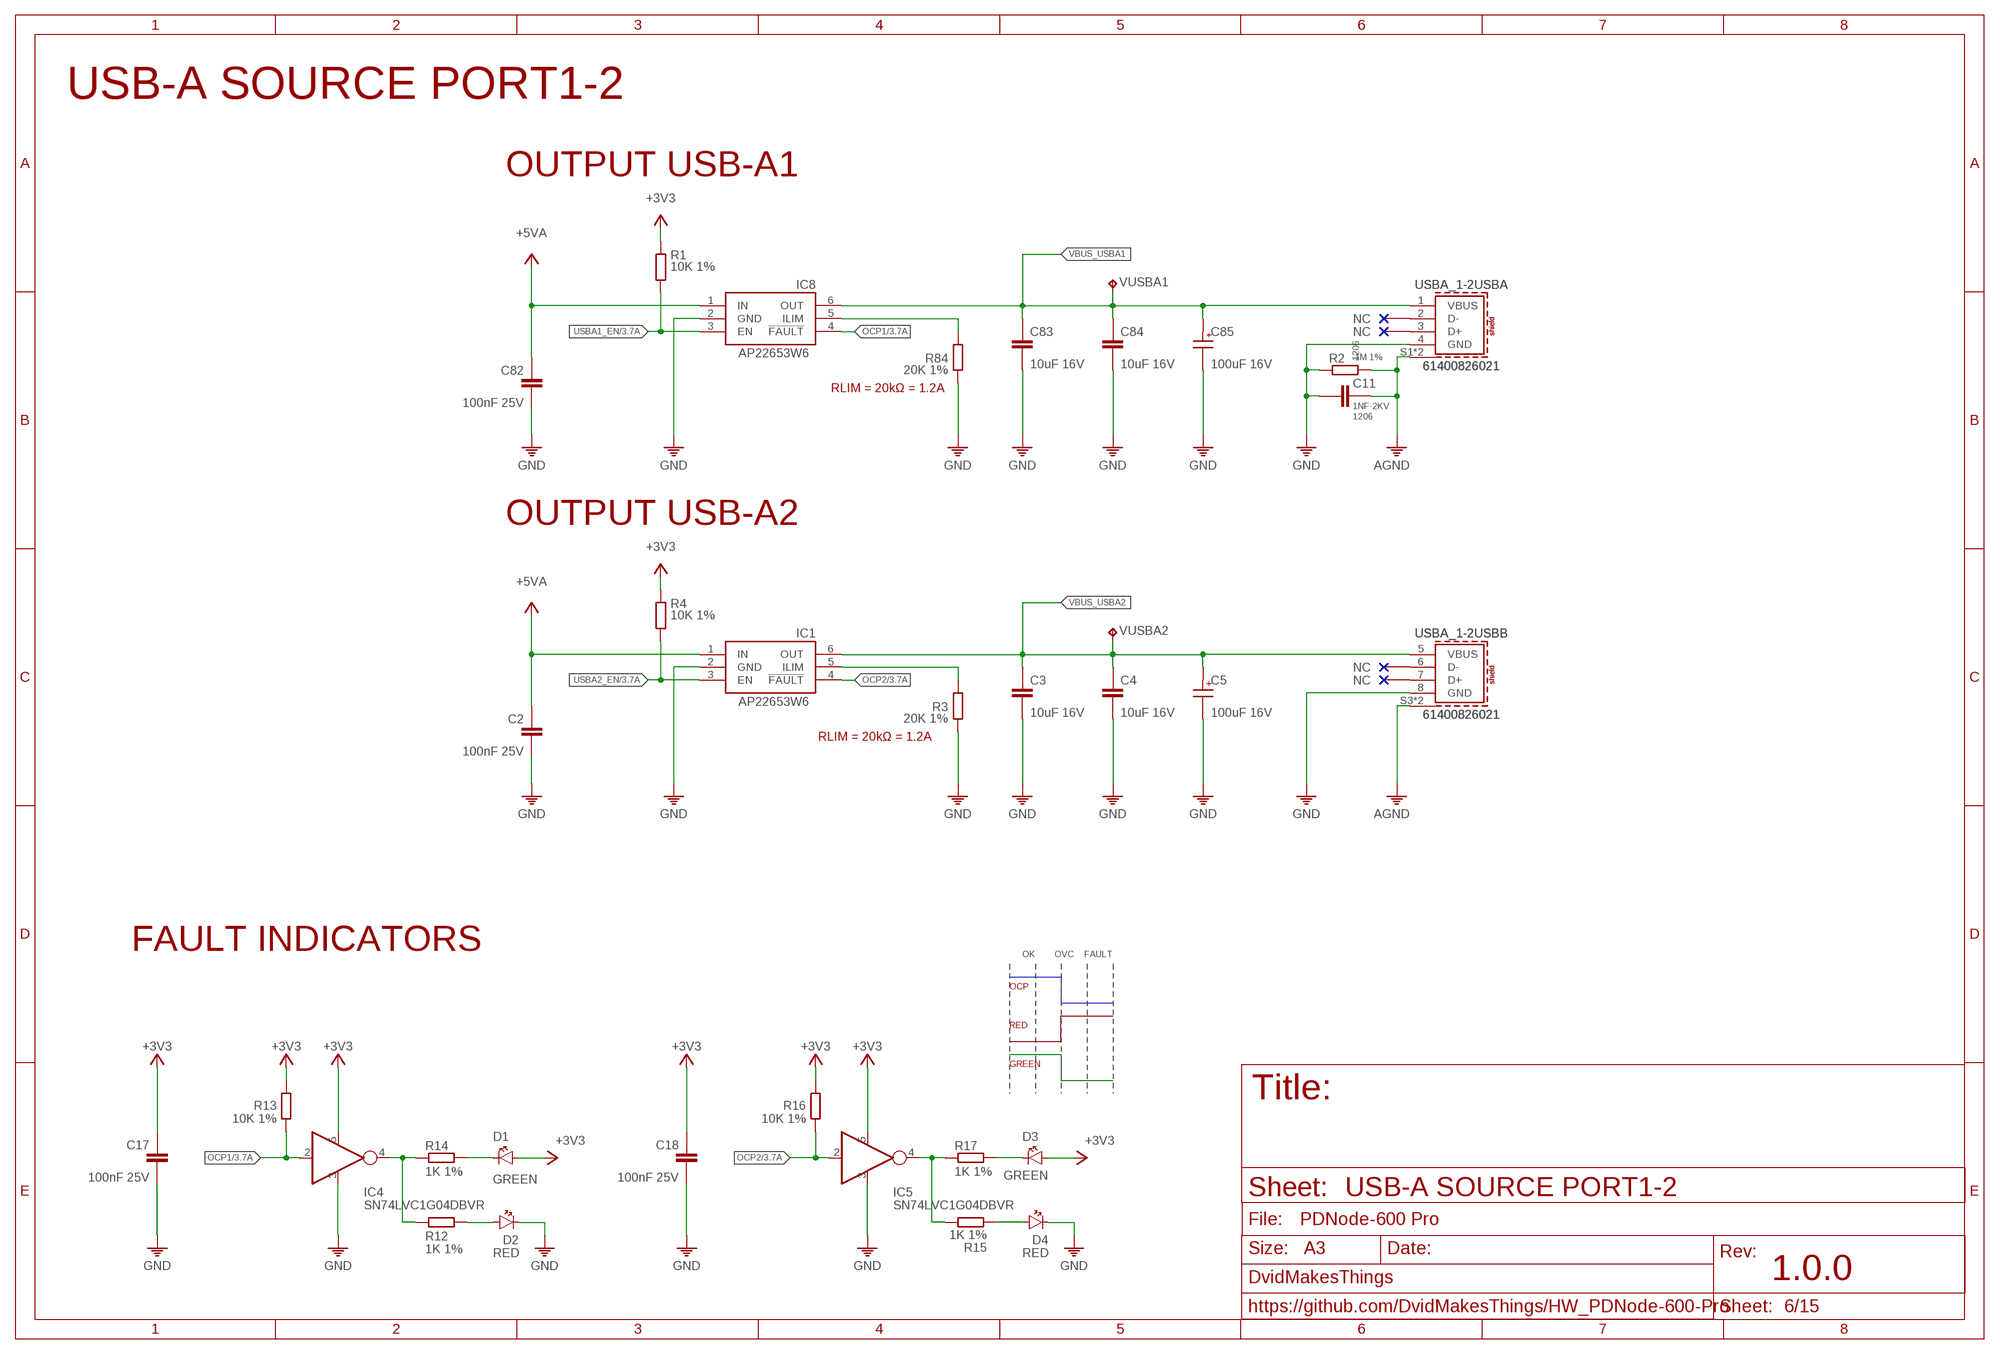
[diagram p5: schematic, sheet 6]

### Parts
C2  100nF 25V  100NF-25V-0201  [0201]
C3  10uF 16V  10UF-16V-0603  [0603]
C4  10uF 16V  10UF-16V-0603  [0603]
C5  100uF 16V  100UF-16V5X5.5(DXL)  [5X5.5(DXL)]
C11  1NF-2KV  [1206]
C17  100nF 25V  100NF-25V-0201  [0201]
C18  100nF 25V  100NF-25V-0201  [0201]
C82  100nF 25V  100NF-25V-0201  [0201]
C83  10uF 16V  10UF-16V-0603  [0603]
C84  10uF 16V  10UF-16V-0603  [0603]
C85  100uF 16V  100UF-16V5X5.5(DXL)  [5X5.5(DXL)]
D1  GREEN  CHIP-FLAT-G_0603-0.35MM  [LEDC1608X35N_FLAT-G]
D2  RED  CHIP-FLAT-R_0603-0.35MM  [LEDC1608X35N_FLAT-R]
D3  GREEN  CHIP-FLAT-G_0603-0.35MM  [LEDC1608X35N_FLAT-G]
D4  RED  CHIP-FLAT-R_0603-0.35MM  [LEDC1608X35N_FLAT-R]
IC1  AP22653W6  [SOT23-6]
IC4  SN74LVC1G04DBVR  74LVC1G04  [SOT95P280X145-5N]
IC5  SN74LVC1G04DBVR  74LVC1G04  [SOT95P280X145-5N]
IC8  AP22653W6  [SOT23-6]
R1  10K 1%  10K-1%0402  [0402]
R2  1M 1%  1M-1%1206  [1206]
R3  20K 1%  20K-1%0201  [0201]
R4  10K 1%  10K-1%0402  [0402]
R12  1K 1%  1K-1%0402  [0402]
R13  10K 1%  10K-1%0402  [0402]
R14  1K 1%  1K-1%0402  [0402]
R15  1K 1%  1K-1%0402  [0402]
R16  10K 1%  10K-1%0402  [0402]
R17  1K 1%  1K-1%0402  [0402]
R84  20K 1%  20K-1%0201  [0201]
USBA_1-2  61400826021  [61400826021]
VUSBA1  TPB1,27  [B1,27]
VUSBA2  TPB1,27  [B1,27]

### Nets
+3V3: C17.1 C18.1 D1.A D3.A IC4.5(V+) IC5.5(V+) R1.1 R4.1 R13.2 R16.2 ; also sheet 1,2,3,4,5,7,8
+5VA: C2.1 C82.1 IC1.1(IN) IC8.1(IN) ; also sheet 5
AGND: C11.1 R2.2 USBA_1-2.S1(USBA:SHIELD) USBA_1-2.S2(USBA:SHIELD) USBA_1-2.S3(USBB:SHIELD) USBA_1-2.S4(USBB:SHIELD) ; also sheet 3,5,7,8
GND: C2.2 C3.2 C4.2 C5.2(-) C11.2 C17.2 C18.2 C82.2 C83.2 C84.2 C85.2(-) D2.C D4.C IC1.2(GND) IC4.3(V-) IC5.3(V-) IC8.2(GND) R2.1 R3.2 R84.2 USBA_1-2.4(USBA:GND) USBA_1-2.8(USBB:GND) ; also sheet 1,2,3,4,5,7,8
N$1: IC1.5(ILIM) R3.1
N$4: D2.A R12.2
N$5: IC4.4(OUT) R12.1 R14.1
N$6: D1.C R14.2
N$7: D4.A R15.1
N$8: IC5.4(OUT) R15.2 R17.1
N$9: D3.C R17.2
N$46: IC8.5(ILIM) R84.1
OCP1: IC4.2(IN) IC8.4(!FAULT) R13.1 ; also sheet 3
OCP2: IC1.4(!FAULT) IC5.2(IN) R16.1 ; also sheet 3
USBA1_EN: IC8.3(EN) R1.2 ; also sheet 3
USBA2_EN: IC1.3(EN) R4.2 ; also sheet 3
VBUS_USBA1: C83.1 C84.1 C85.1(+) IC8.6(OUT) USBA_1-2.1(USBA:VBUS) VUSBA1.TP
VBUS_USBA2: C3.1 C4.1 C5.1(+) IC1.6(OUT) USBA_1-2.5(USBB:VBUS) VUSBA2.TP
Unconnected: USBA_1-2.2(USBA:D-) USBA_1-2.3(USBA:D+) USBA_1-2.6(USBB:D-) USBA_1-2.7(USBB:D+)

### Notes on the sheet
- USB-A SOURCE PORT1-2
- OUTPUT USB-A1
- RLIM = 20kΩ = 1.2A
- OUTPUT USB-A2
- RLIM = 20kΩ = 1.2A
- FAULT INDICATORS | OK | OVC | FAULT
- OCP
- RED
- GREEN
- USB-A SOURCE PORT1-2

## Sheet 7 of 15: USB-A SOURCE PORT3-4
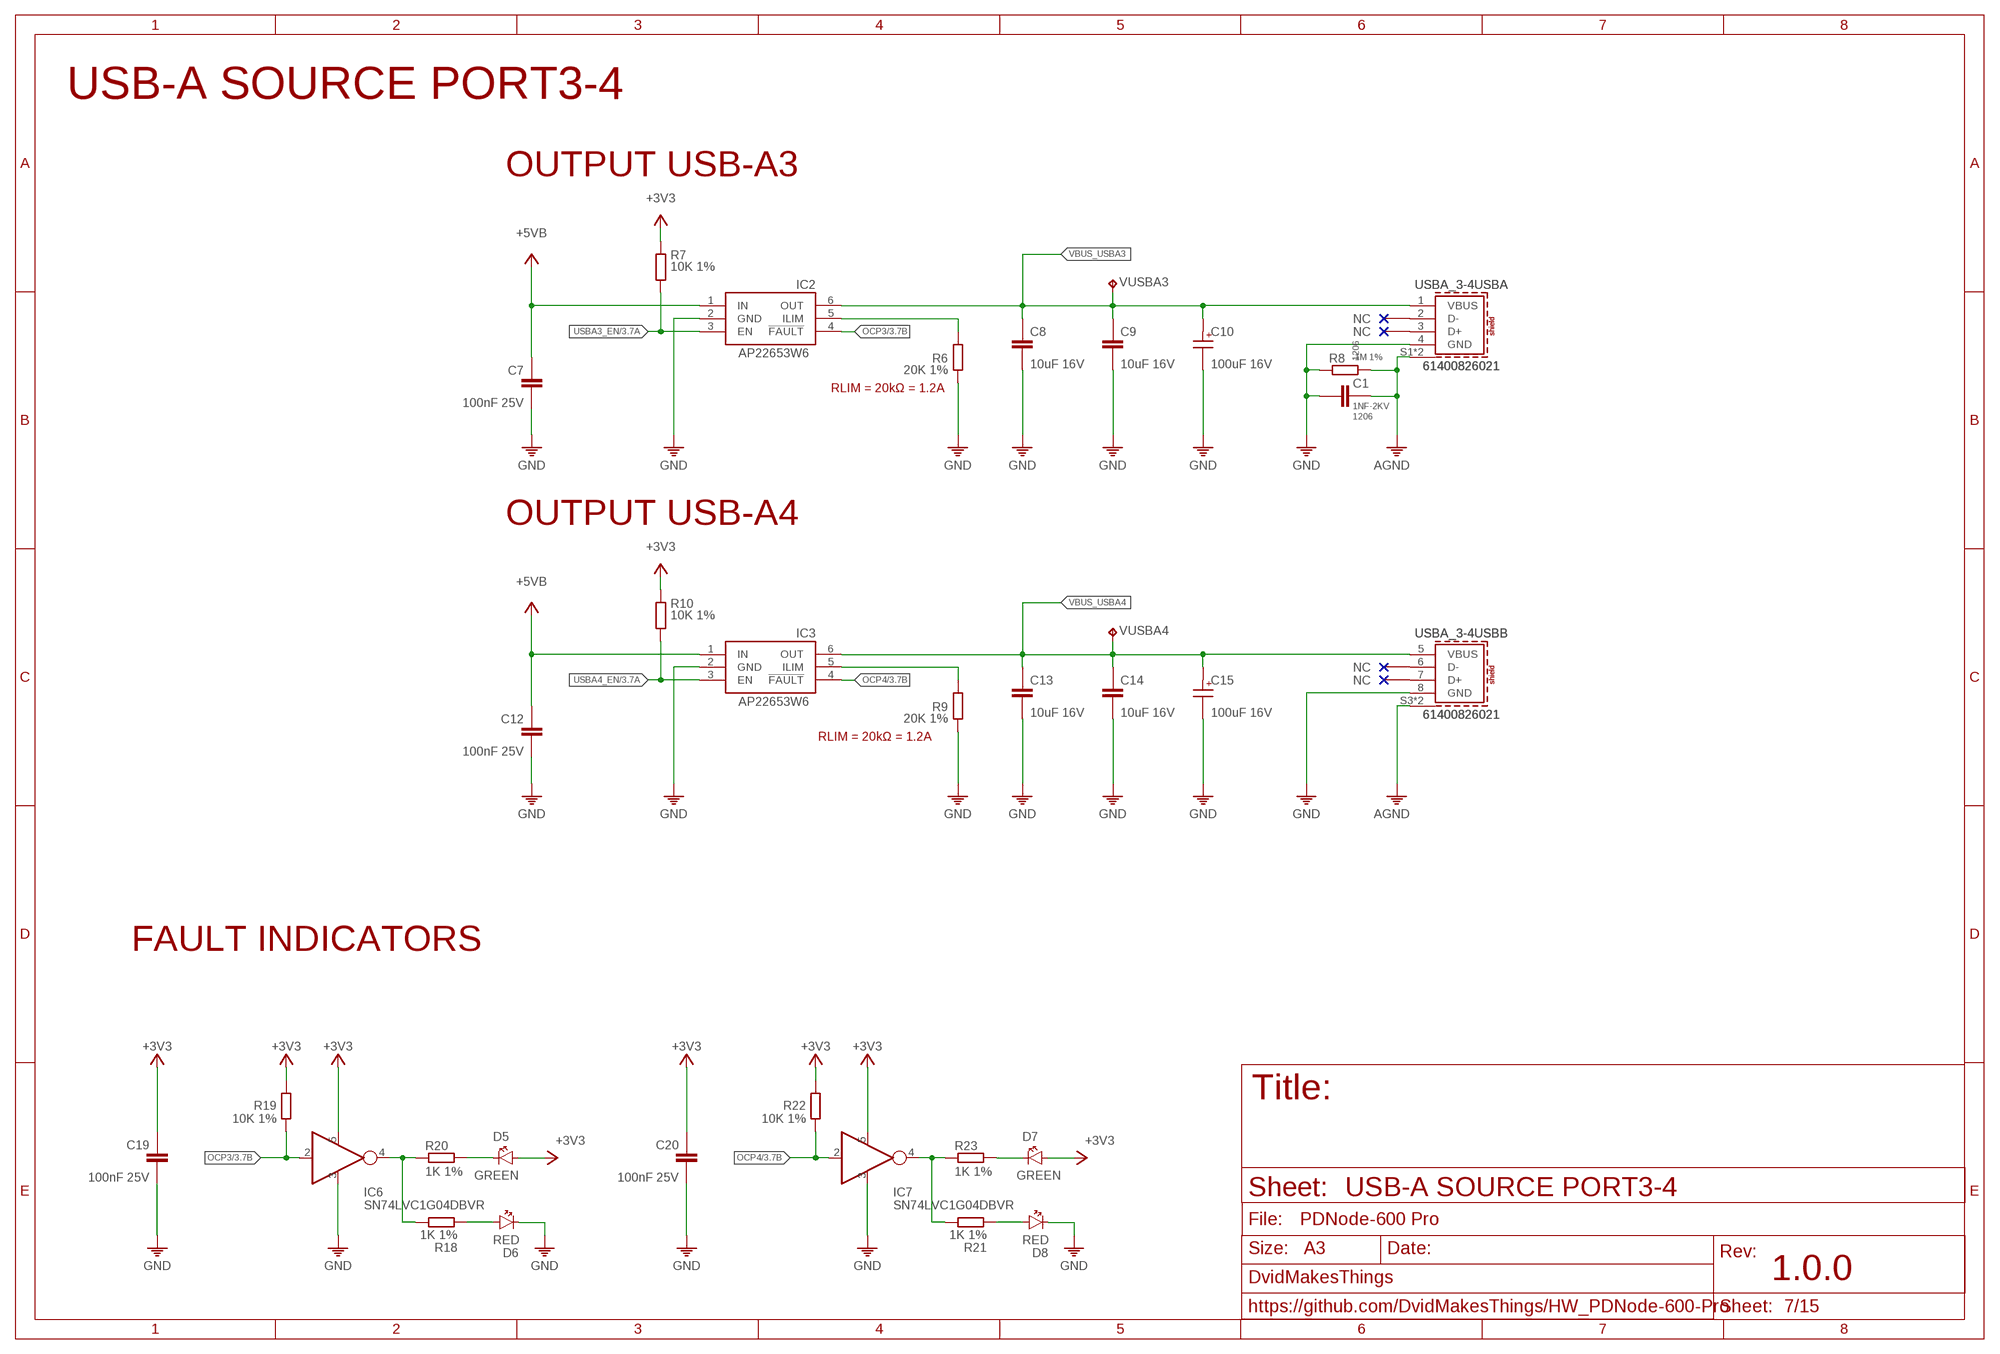
[diagram p6: schematic, sheet 7]

### Parts
C1  1NF-2KV  [1206]
C7  100nF 25V  100NF-25V-0201  [0201]
C8  10uF 16V  10UF-16V-0603  [0603]
C9  10uF 16V  10UF-16V-0603  [0603]
C10  100uF 16V  100UF-16V5X5.5(DXL)  [5X5.5(DXL)]
C12  100nF 25V  100NF-25V-0201  [0201]
C13  10uF 16V  10UF-16V-0603  [0603]
C14  10uF 16V  10UF-16V-0603  [0603]
C15  100uF 16V  100UF-16V5X5.5(DXL)  [5X5.5(DXL)]
C19  100nF 25V  100NF-25V-0201  [0201]
C20  100nF 25V  100NF-25V-0201  [0201]
D5  GREEN  CHIP-FLAT-G_0603-0.35MM  [LEDC1608X35N_FLAT-G]
D6  RED  CHIP-FLAT-R_0603-0.35MM  [LEDC1608X35N_FLAT-R]
D7  GREEN  CHIP-FLAT-G_0603-0.35MM  [LEDC1608X35N_FLAT-G]
D8  RED  CHIP-FLAT-R_0603-0.35MM  [LEDC1608X35N_FLAT-R]
IC2  AP22653W6  [SOT23-6]
IC3  AP22653W6  [SOT23-6]
IC6  SN74LVC1G04DBVR  74LVC1G04  [SOT95P280X145-5N]
IC7  SN74LVC1G04DBVR  74LVC1G04  [SOT95P280X145-5N]
R6  20K 1%  20K-1%0201  [0201]
R7  10K 1%  10K-1%0402  [0402]
R8  1M 1%  1M-1%1206  [1206]
R9  20K 1%  20K-1%0201  [0201]
R10  10K 1%  10K-1%0402  [0402]
R18  1K 1%  1K-1%0402  [0402]
R19  10K 1%  10K-1%0402  [0402]
R20  1K 1%  1K-1%0402  [0402]
R21  1K 1%  1K-1%0402  [0402]
R22  10K 1%  10K-1%0402  [0402]
R23  1K 1%  1K-1%0402  [0402]
USBA_3-4  61400826021  [61400826021]
VUSBA3  TPB1,27  [B1,27]
VUSBA4  TPB1,27  [B1,27]

### Nets
+3V3: C19.1 C20.1 D5.A D7.A IC6.5(V+) IC7.5(V+) R7.1 R10.1 R19.2 R22.2 ; also sheet 1,2,3,4,5,6,8
+5VB: C7.1 C12.1 IC2.1(IN) IC3.1(IN) ; also sheet 5
AGND: C1.1 R8.2 USBA_3-4.S1(USBA:SHIELD) USBA_3-4.S2(USBA:SHIELD) USBA_3-4.S3(USBB:SHIELD) USBA_3-4.S4(USBB:SHIELD) ; also sheet 3,5,6,8
GND: C1.2 C7.2 C8.2 C9.2 C10.2(-) C12.2 C13.2 C14.2 C15.2(-) C19.2 C20.2 D6.C D8.C IC2.2(GND) IC3.2(GND) IC6.3(V-) IC7.3(V-) R6.2 R8.1 R9.2 USBA_3-4.4(USBA:GND) USBA_3-4.8(USBB:GND) ; also sheet 1,2,3,4,5,6,8
N$2: IC2.5(ILIM) R6.1
N$3: IC3.5(ILIM) R9.1
N$10: D6.A R18.1
N$11: IC6.4(OUT) R18.2 R20.1
N$12: D5.C R20.2
N$13: D8.A R21.1
N$14: IC7.4(OUT) R21.2 R23.1
N$15: D7.C R23.2
OCP3: IC2.4(!FAULT) IC6.2(IN) R19.1 ; also sheet 3
OCP4: IC3.4(!FAULT) IC7.2(IN) R22.1 ; also sheet 3
USBA3_EN: IC2.3(EN) R7.2 ; also sheet 3
USBA4_EN: IC3.3(EN) R10.2 ; also sheet 3
VBUS_USBA3: C8.1 C9.1 C10.1(+) IC2.6(OUT) USBA_3-4.1(USBA:VBUS) VUSBA3.TP
VBUS_USBA4: C13.1 C14.1 C15.1(+) IC3.6(OUT) USBA_3-4.5(USBB:VBUS) VUSBA4.TP
Unconnected: USBA_3-4.2(USBA:D-) USBA_3-4.3(USBA:D+) USBA_3-4.6(USBB:D-) USBA_3-4.7(USBB:D+)

### Notes on the sheet
- USB-A SOURCE PORT3-4
- OUTPUT USB-A3
- RLIM = 20kΩ = 1.2A
- OUTPUT USB-A4
- RLIM = 20kΩ = 1.2A
- FAULT INDICATORS
- USB-A SOURCE PORT3-4

## Sheet 8 of 15: USB-C PD SOURCE PORT1
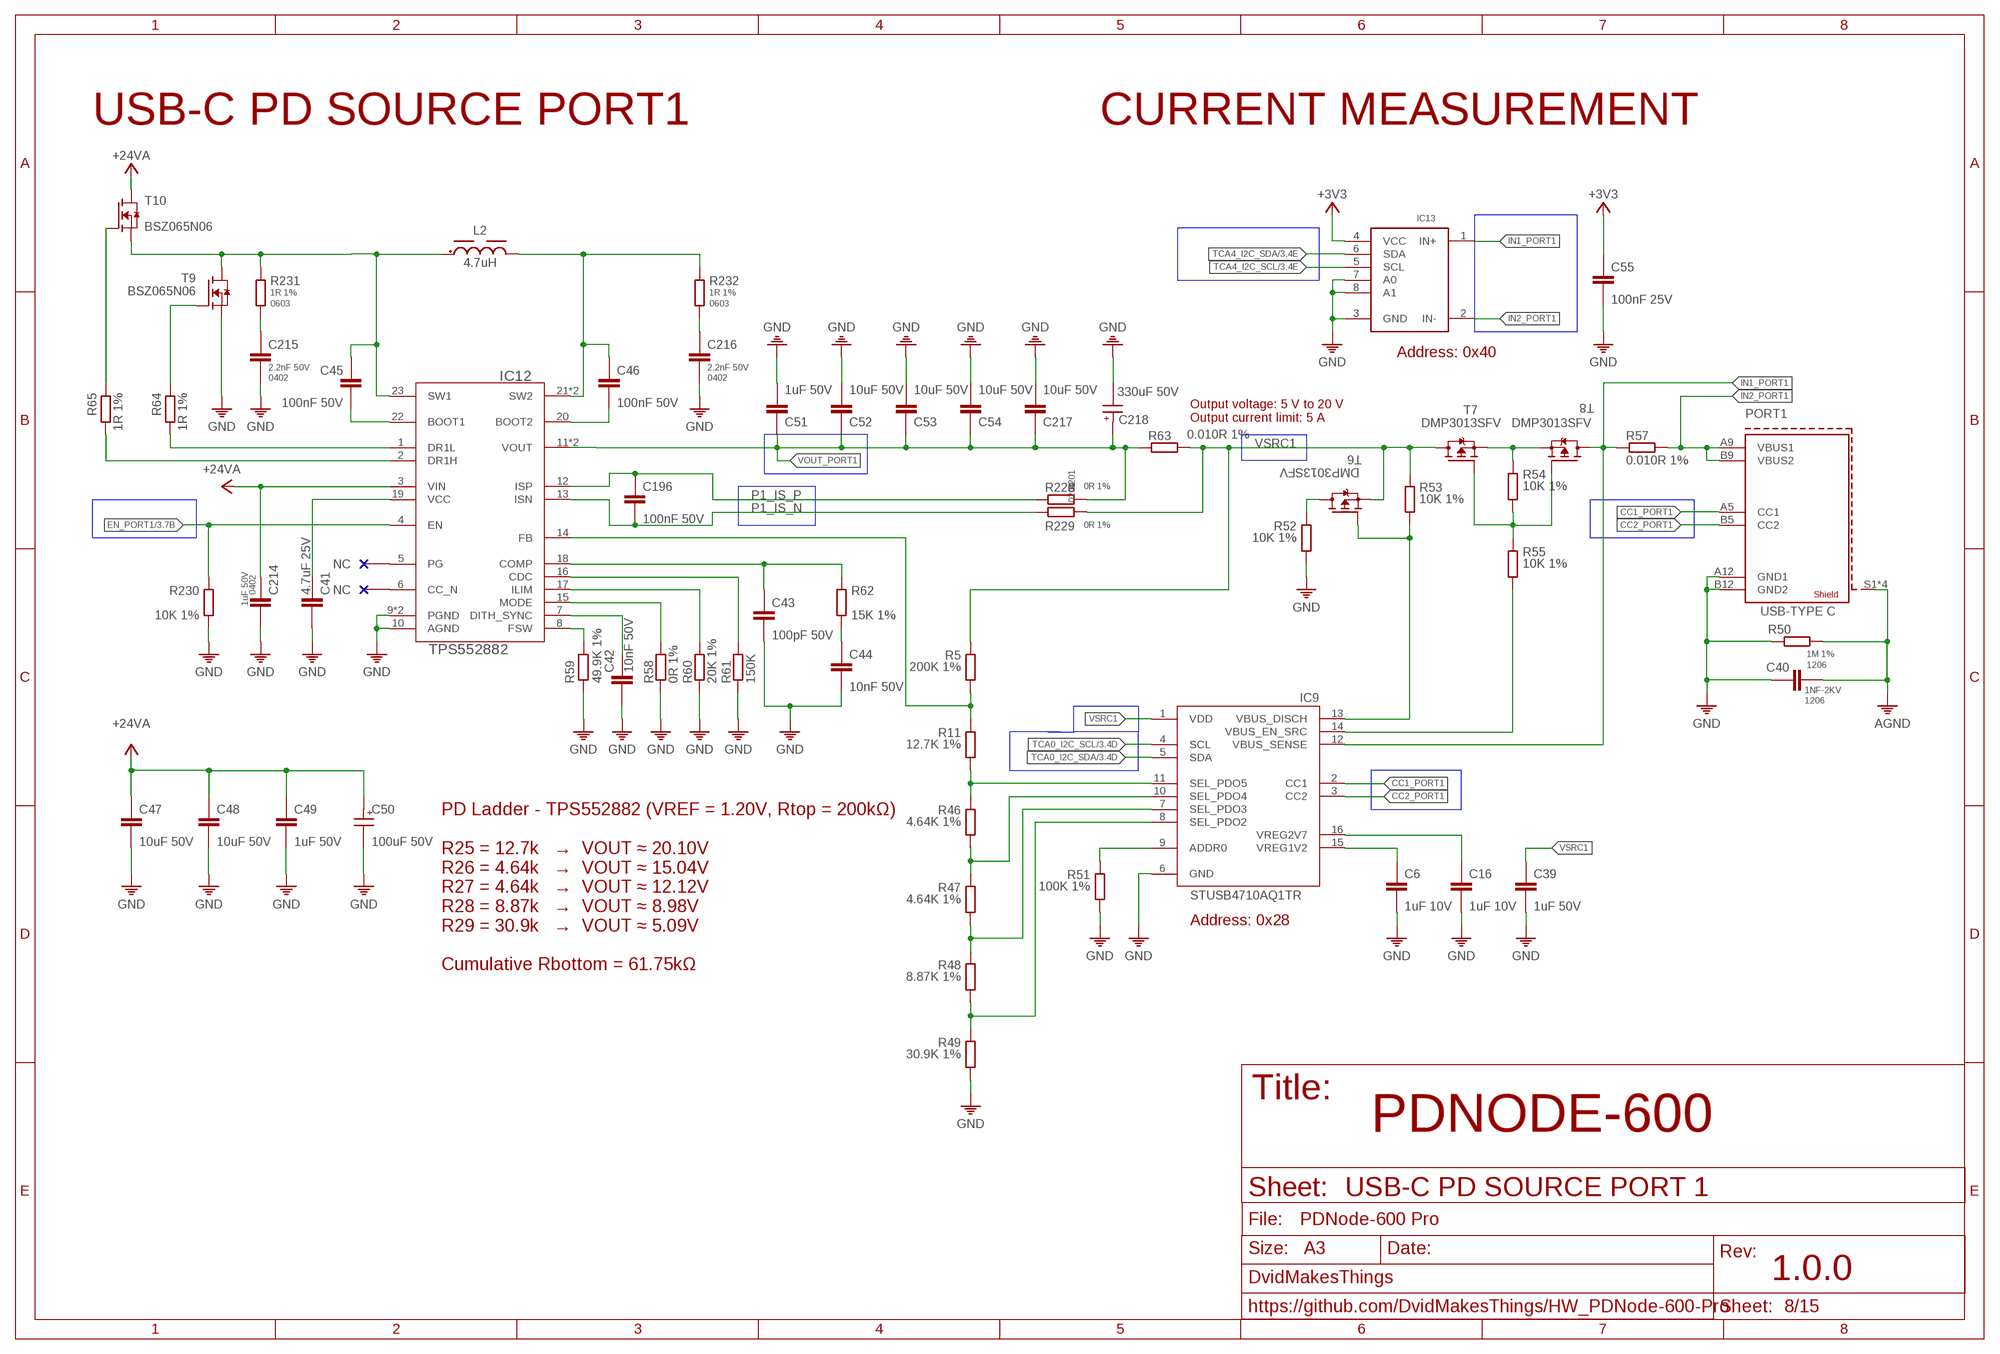
[diagram p7: schematic, sheet 8]

### Parts
C6  1uF 10V  1UF-10V0201  [0201]
C16  1uF 10V  1UF-10V0201  [0201]
C39  1uF 50V  1UF-50V0603  [0603]
C40  1NF-2KV  [1206]
C41  4.7uF 25V  4.7UF-25V0402  [0402]
C42  10nF 50V  10NF-50V-0201  [0201]
C43  100pF 50V  100PF-50V-0402  [0402]
C44  10nF 50V  10NF-50V-0201  [0201]
C45  100nF 50V  100NF-50V-0402  [0402]
C46  100nF 50V  100NF-50V-0402  [0402]
C47  10uF 50V  10UF-50V-0805  [0805]
C48  10uF 50V  10UF-50V-0805  [0805]
C49  1uF 50V  1UF-50V0805  [0805]
C50  100uF 50V  100UF-50V6.3X7.7(DXL)  [6.3X7.7(DXL)]
C51  1uF 50V  1UF-50V0402  [0402]
C52  10uF 50V  10UF-50V-0805  [0805]
C53  10uF 50V  10UF-50V-0805  [0805]
C54  10uF 50V  10UF-50V-0805  [0805]
C55  100nF 25V  100NF-25V-0201  [0201]
C196  100nF 50V  100NF-50V-0402  [0402]
C214  1uF 50V  1UF-50V0402  [0402]
C215  2.2nF 50V  2.2NF-50V-0402  [0402]
C216  2.2nF 50V  2.2NF-50V-0402  [0402]
C217  10uF 50V  10UF-50V-0805  [0805]
C218  330uF 50V  330UF-50V10X10.5(DXL)  [10X10.5(DXL)]
IC9  STUSB4710AQ1TR  [QFN50P300X300X55-16N]
IC12  TPS552882  [RPM0026A-MFG]
IC13  INA219BIDCNT  [SOT23-8]
L2  4.7uH  WE-PD_1280_74477004  [WE-PD_1280]
PORT1  632722100213  USB-C-POWERONLY  [632722100213]
R5  200K 1%  200K-1%0201  [0201]
R11  12.7K 1%  12.7K-1%0201  [0201]
R46  4.64K 1%  4.64K-1%-0201  [0201]
R47  4.64K 1%  4.64K-1%-0201  [0201]
R48  8.87K 1%  8.87K-1%-0201  [0201]
R49  30.9K 1%  30.9K-1%0201  [0201]
R50  1M 1%  1M-1%1206  [1206]
R51  100K 1%  100K-1%0201  [0201]
R52  10K 1%  10K-1%0402  [0402]
R53  10K 1%  10K-1%0402  [0402]
R54  10K 1%  10K-1%0201  [0201]
R55  10K 1%  10K-1%0402  [0402]
R57  0.010R 1%  0.010R-1%-2512  [2512]
R58  0R 1%  0R0201  [0201]
R59  49.9K 1%  49.9K-1%0201  [0201]
R60  20K 1%  20K-1%0201  [0201]
R61  150K  R0201  [R0201]
R62  15K 1%  15K-1%0201  [0201]
R63  0.010R 1%  0.010R-1%-2512  [2512]
R64  1R 1%  1R-1%0402  [0402]
R65  1R 1%  1R-1%0402  [0402]
R228  0R 1%  0R0201  [0201]
R229  0R 1%  0R0201  [0201]
R230  10K 1%  10K-1%0201  [0201]
R231  1R 1%  1R-1%0603  [0603]
R232  1R 1%  1R-1%0603  [0603]
T6  DMP3013SFV  DMP3013SFV-7UX  [POWERDI3333-8_UX_DIO-L]
T7  DMP3013SFV  DMP3013SFV-7UX  [POWERDI3333-8_UX_DIO-L]
T8  DMP3013SFV  DMP3013SFV-7UX  [POWERDI3333-8_UX_DIO-L]
T9  BSZ065N06  IPZ40N04S5L7R4ATMA1  [POWERDI3333-8_UX_DIO-L]
T10  BSZ065N06  IPZ40N04S5L7R4ATMA1  [POWERDI3333-8_UX_DIO-L]

### Nets
+3V3: C55.1 IC13.4(VCC) ; also sheet 1,2,3,4,5,6,7
+24V_A: C47.1 C48.1 C49.1 C50.1(+) C214.1 IC12.3(VIN) T10.5(D) T10.6(D) T10.7(D) T10.8(D) T10.9(D) ; supply symbol labelled +24VA ; also sheet 5
AGND: C40.2 PORT1.S1(SHIELD1) PORT1.S2(SHIELD1) PORT1.S3(SHIELD1) PORT1.S4(SHIELD1) R50.2 ; also sheet 3,5,6,7
CC1_PORT1: IC9.2(CC1) PORT1.A5(CC1)
CC2_PORT1: IC9.3(CC2) PORT1.B5(CC2)
EN_PORT1: IC12.4(EN) R230.1 ; also sheet 3
GND: C6.2 C16.2 C39.2 C40.1 C41.2 C42.2 C43.2 C44.2 C47.2 C48.2 C49.2 C50.2(-) C51.2 C52.2 C53.2 C54.2 C55.2 C214.2 C215.2 C216.2 C217.2 C218.2(-) IC9.6(GND) IC12.9(PGND) IC12.10(AGND) IC12.24(PGND) IC13.3(GND) IC13.7(A0) IC13.8(A1) PORT1.A12(GND1) PORT1.B12(GND2) R49.2 R50.1 R51.2 R52.2 R58.2 R59.2 R60.2 R61.2 R230.2 T9.1(S) T9.2(S) T9.3(S) ; also sheet 1,2,3,4,5,6,7
IN1_PORT1: IC9.12(VBUS_SENSE) IC13.1(IN+) R57.1 T8.5(D) T8.6(D) T8.7(D) T8.8(D) T8.9(D)
IN2_PORT1: IC13.2(IN-) PORT1.A9(VBUS1) PORT1.B9(VBUS2) R57.2
N$31: IC12.14(FB) R5.2 R11.1
N$33: C215.1 R231.2
N$34: C216.1 R232.2
N$48: IC9.11(SEL_PDO5) R11.2 R46.1
N$49: IC9.10(SEL_PDO4) R46.2 R47.1
N$50: IC9.7(SEL_PDO3) R47.2 R48.1
N$51: IC9.8(SEL_PDO2) R48.2 R49.1
N$52: C6.1 IC9.15(VREG1V2)
N$53: C16.1 IC9.16(VREG2V7)
N$54: IC9.9(ADDR0) R51.1
N$55: R52.1 T6.5(D) T6.6(D) T6.7(D) T6.8(D) T6.9(D)
N$56: IC9.13(VBUS_DISCH) R53.2 T6.4(G)
N$57: R54.1 T7.1(S) T7.2(S) T7.3(S) T8.1(S) T8.2(S) T8.3(S)
N$58: R54.2 R55.1 T7.4(G) T8.4(G)
N$59: IC9.14(VBUS_EN_SRC) R55.2
N$60: C44.1 R62.2
N$61: IC12.8(FSW) R59.1
N$62: C42.1 IC12.7(DITH_SYNC)
N$63: IC12.15(MODE) R58.1
N$64: IC12.17(ILIM) R60.1
N$65: IC12.16(CDC) R61.1
N$66: C43.1 IC12.18(COMP) R62.1
N$67: C41.1 IC12.19(VCC)
N$68: C45.1 IC12.23(SW1) L2.1 R231.1 T9.5(D) T9.6(D) T9.7(D) T9.8(D) T9.9(D) T10.1(S) T10.2(S) T10.3(S)
N$69: C46.1 IC12.21(SW2) IC12.25(SW2) L2.2 R232.1
N$70: C45.2 IC12.22(BOOT1)
N$71: C46.2 IC12.20(BOOT2)
N$72: R65.2 T10.4(G)
N$73: R64.2 T9.4(G)
N$74: IC12.1(DR1L) R64.1
N$75: IC12.2(DR1H) R65.1
P1_IS_N [50R_DIFFPAIR]: C196.2 IC12.13(ISN) R229.1
P1_IS_P [50R_DIFFPAIR]: C196.1 IC12.12(ISP) R228.1
TCA0_I2C_SCL: IC9.4(SCL) ; also sheet 3
TCA0_I2C_SDA: IC9.5(SDA) ; also sheet 3
TCA4_I2C_SCL: IC13.5(SCL) ; also sheet 3
TCA4_I2C_SDA: IC13.6(SDA) ; also sheet 3
VOUT_PORT1: C51.1 C52.1 C53.1 C54.1 C217.1 C218.1(+) IC12.11(VOUT) IC12.26(VOUT) R63.1 R228.2
VSRC1: C39.1 IC9.1(VDD) R5.1 R53.1 R63.2 R229.2 T6.1(S) T6.2(S) T6.3(S) T7.5(D) T7.6(D) T7.7(D) T7.8(D) T7.9(D)
Unconnected: IC12.5(PG) IC12.6(CC_N)

### Notes on the sheet
- USB-C PD SOURCE PORT1 | CURRENT MEASUREMENT
- Address: 0x40
- Output voltage: 5 V to 20 V
  Output current limit: 5 A
- Address: 0x28
- PD Ladder - TPS552882 (VREF = 1.20V, Rtop = 200kΩ)
  
  R25 = 12.7k   →  VOUT ≈ 20.10V
  R26 = 4.64k   →  VOUT ≈ 15.04V
  R27 = 4.64k   →  VOUT ≈ 12.12V
  R28 = 8.87k   →  VOUT ≈ 8.98V
  R29 = 30.9k   →  VOUT ≈ 5.09V
  
  Cumulative Rbottom = 61.75kΩ
- PDNODE-600
- USB-C PD SOURCE PORT 1

## Sheet 9 of 15: USB-C PD SOURCE PORT2

## Sheet 10 of 15: USB-C PD SOURCE PORT3

## Sheet 11 of 15: USB-C PD SOURCE PORT4

## Sheet 12 of 15: USB-C PD SOURCE PORT5

## Sheet 13 of 15: USB-C PD SOURCE PORT6

## Sheet 14 of 15: USB-C PD SOURCE PORT7

## Sheet 15 of 15: USB-C PD SOURCE PORT8